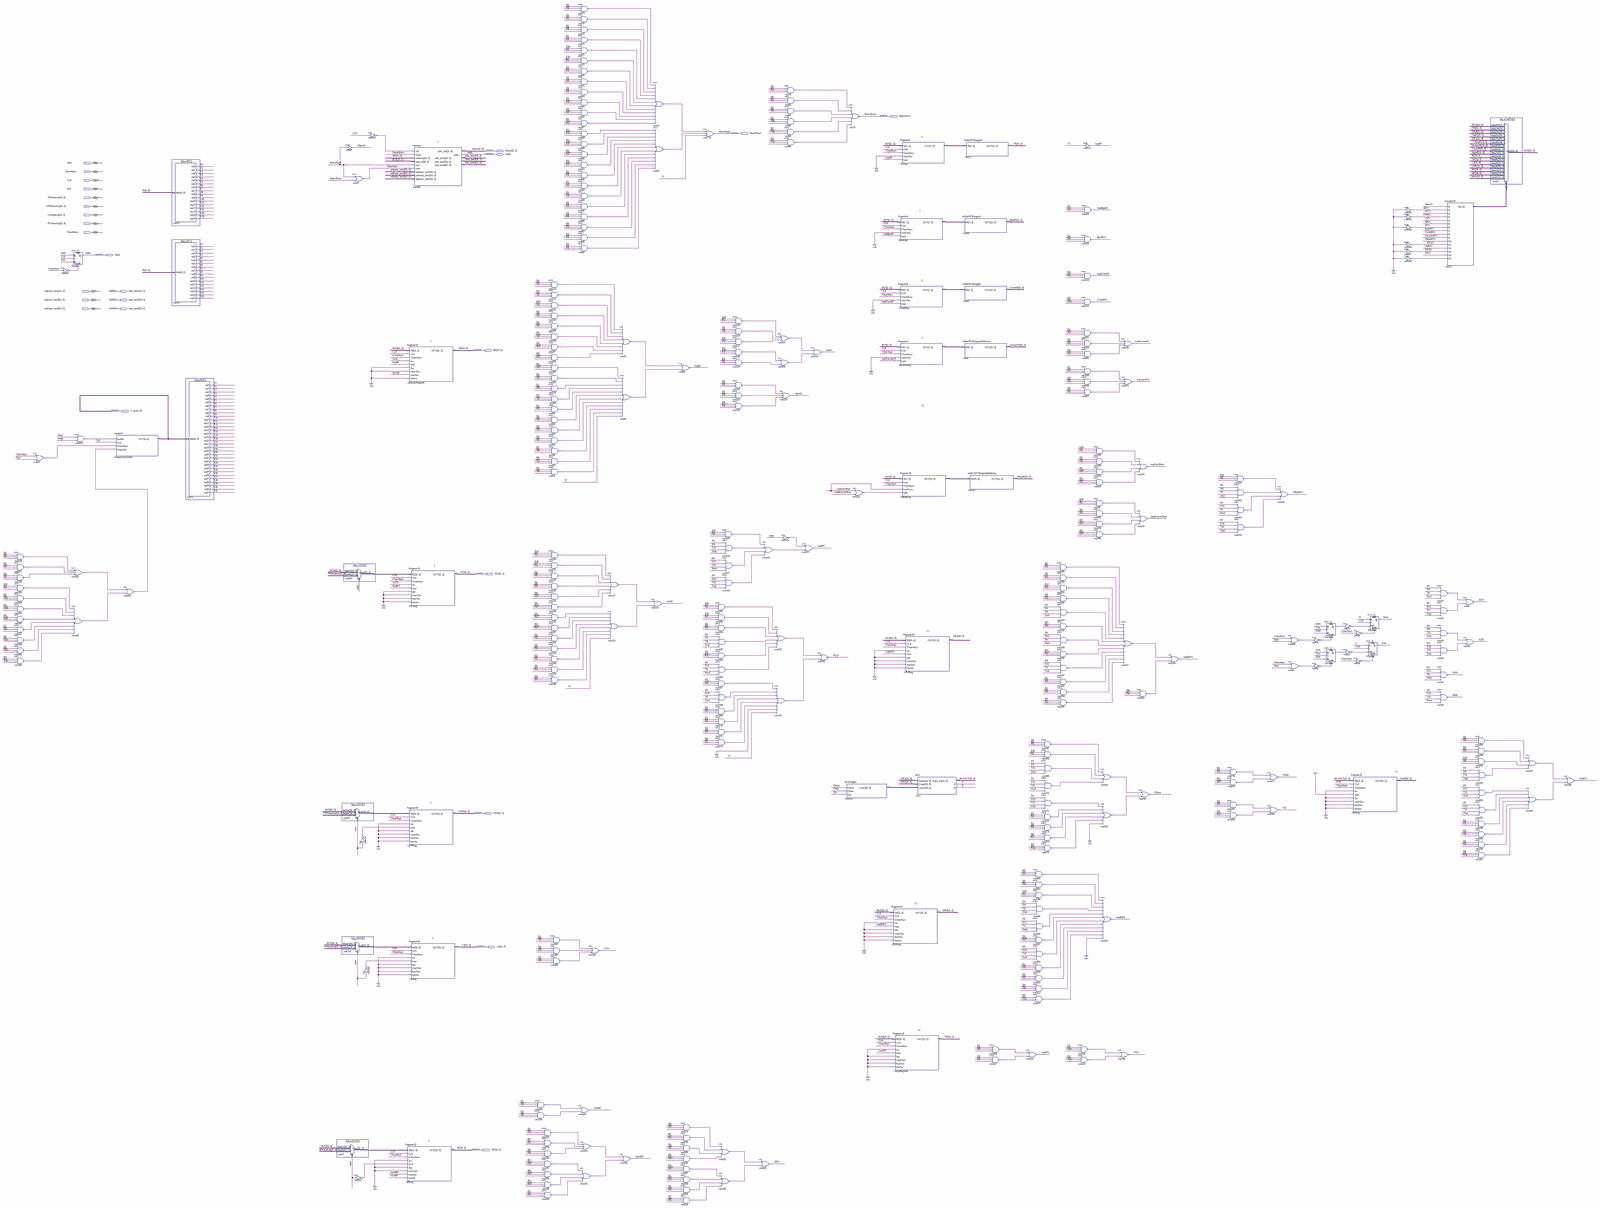
[diagram p0: schematic sheet, whole]
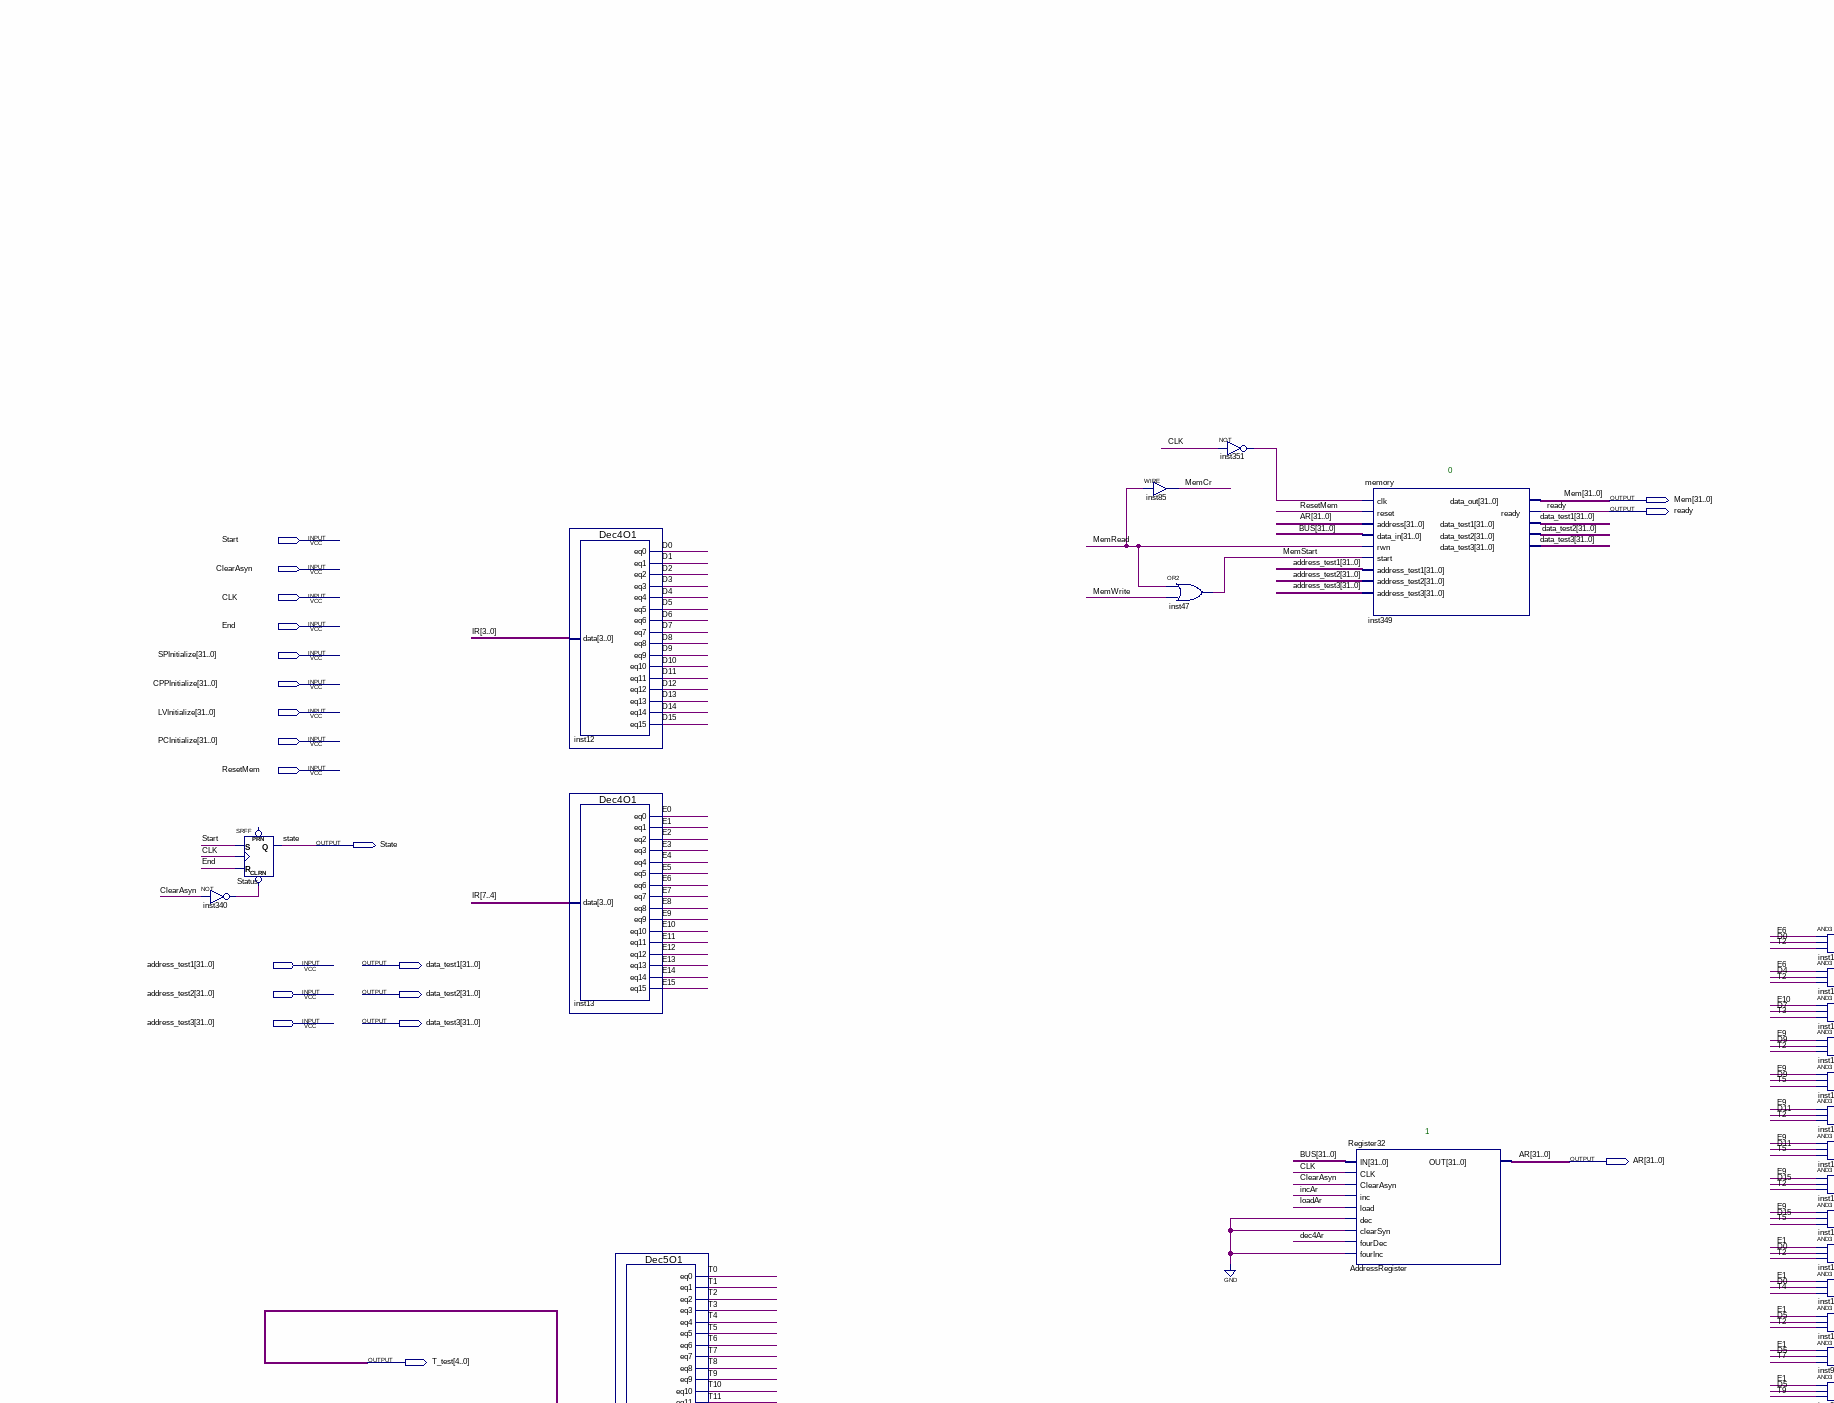
[diagram p1: schematic sheet, upper left part]
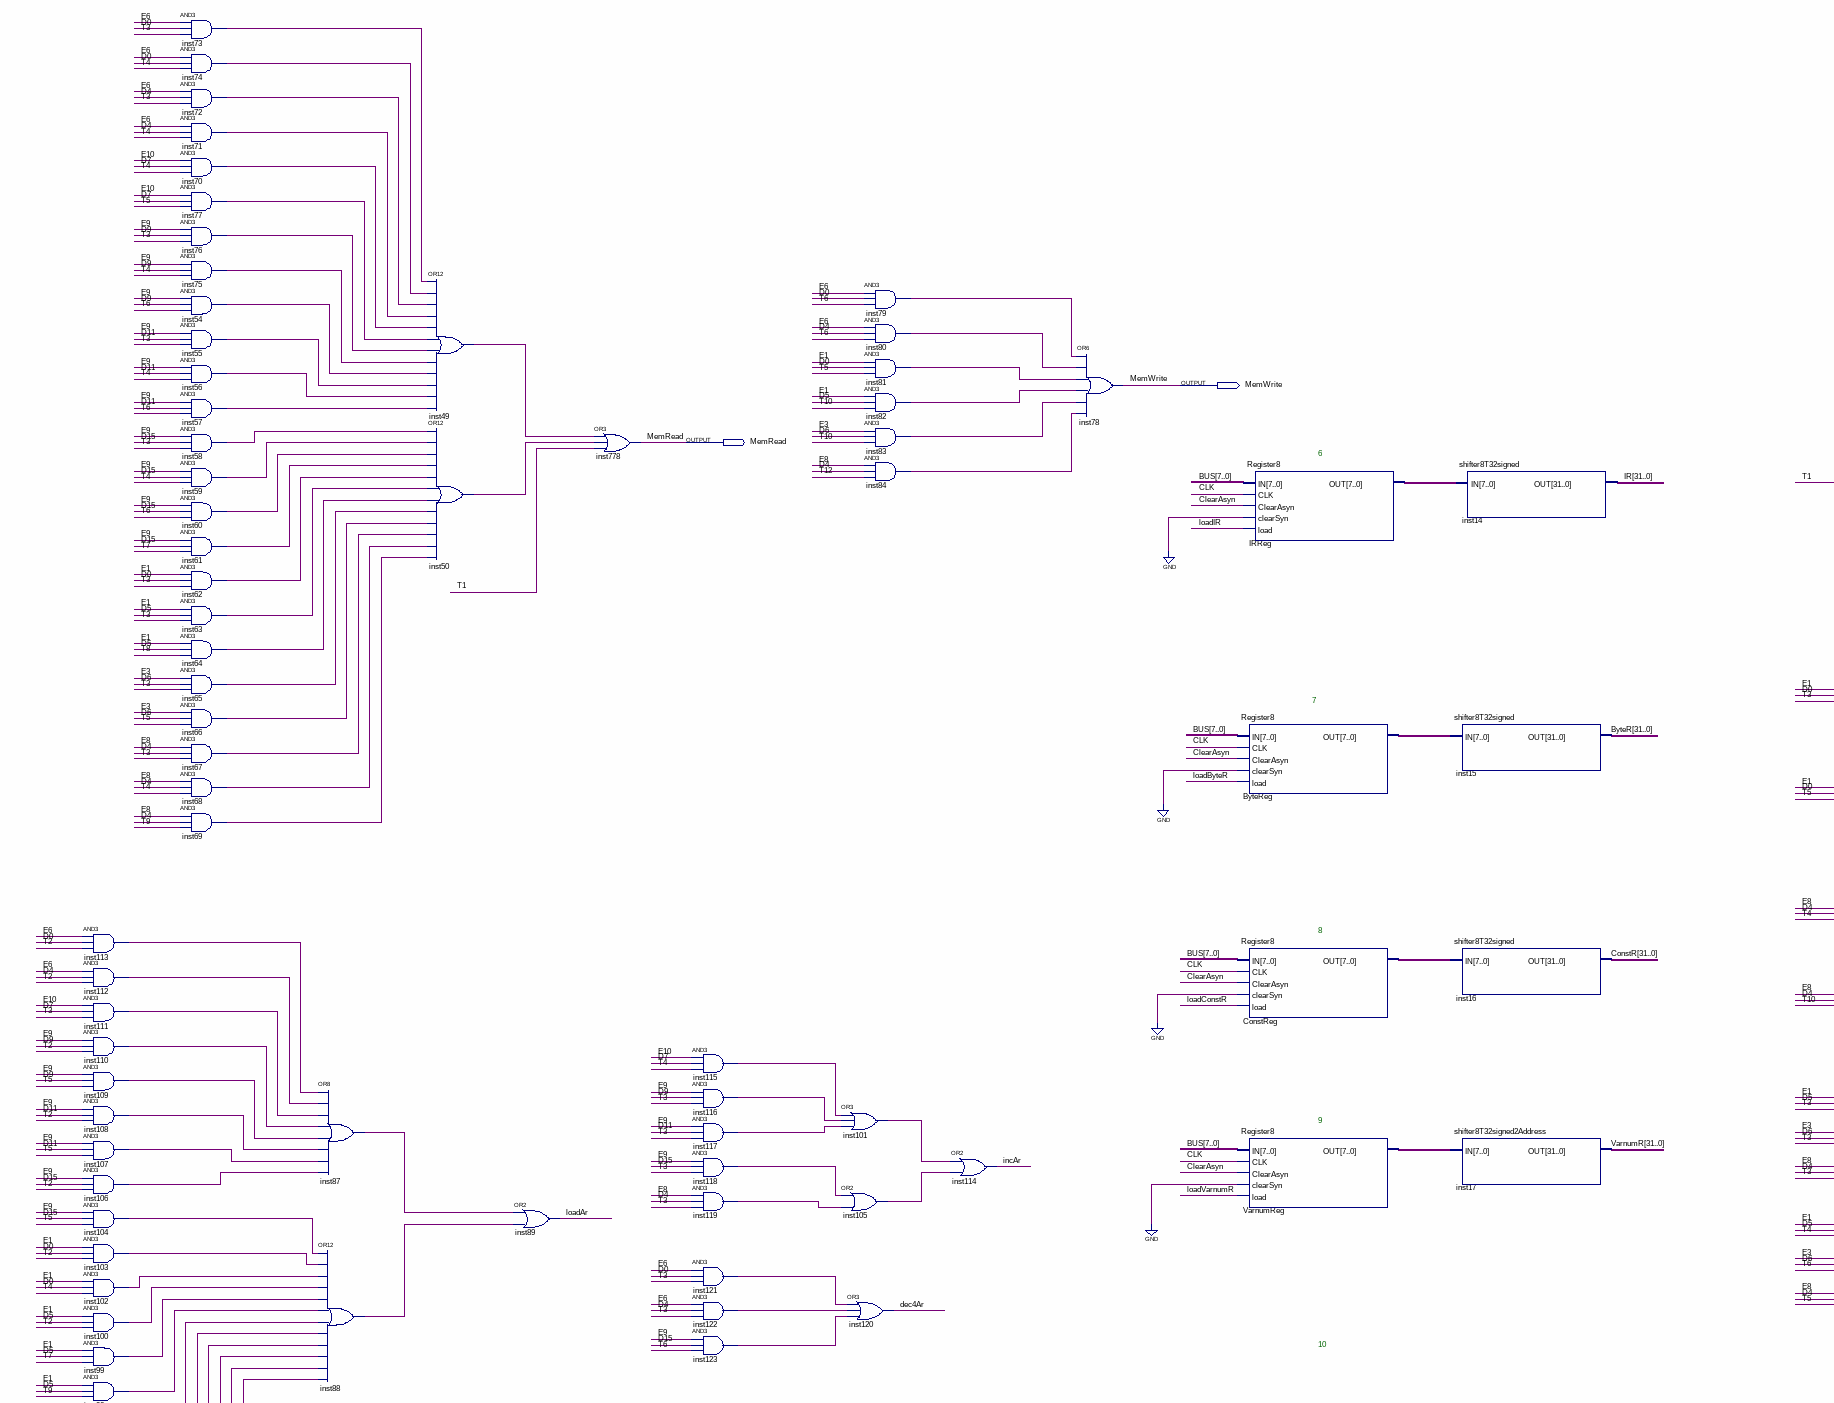
[diagram p2: schematic sheet, upper centre part]
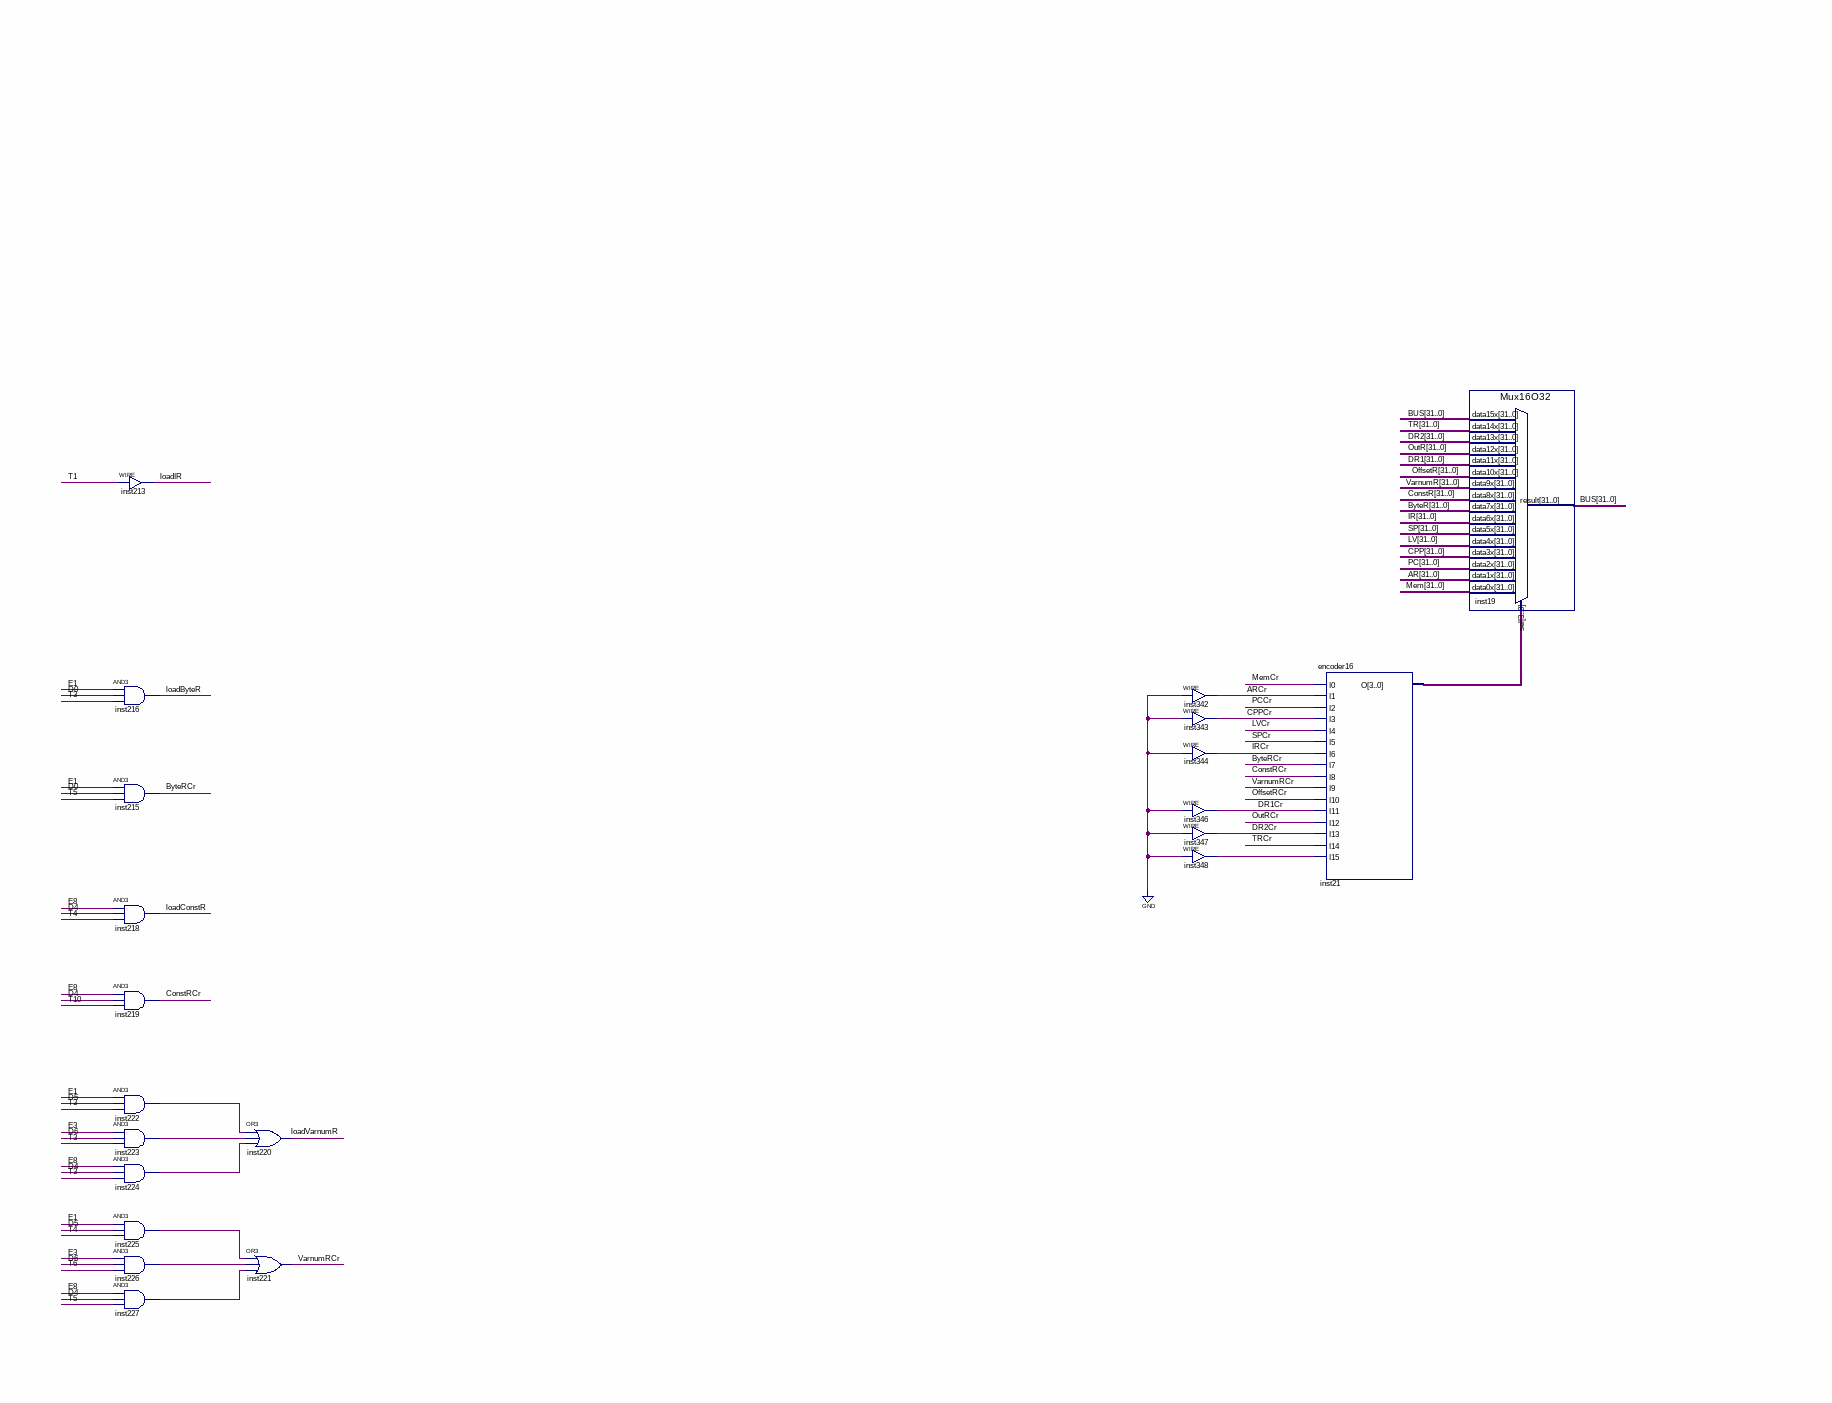
[diagram p3: schematic sheet, upper right part]
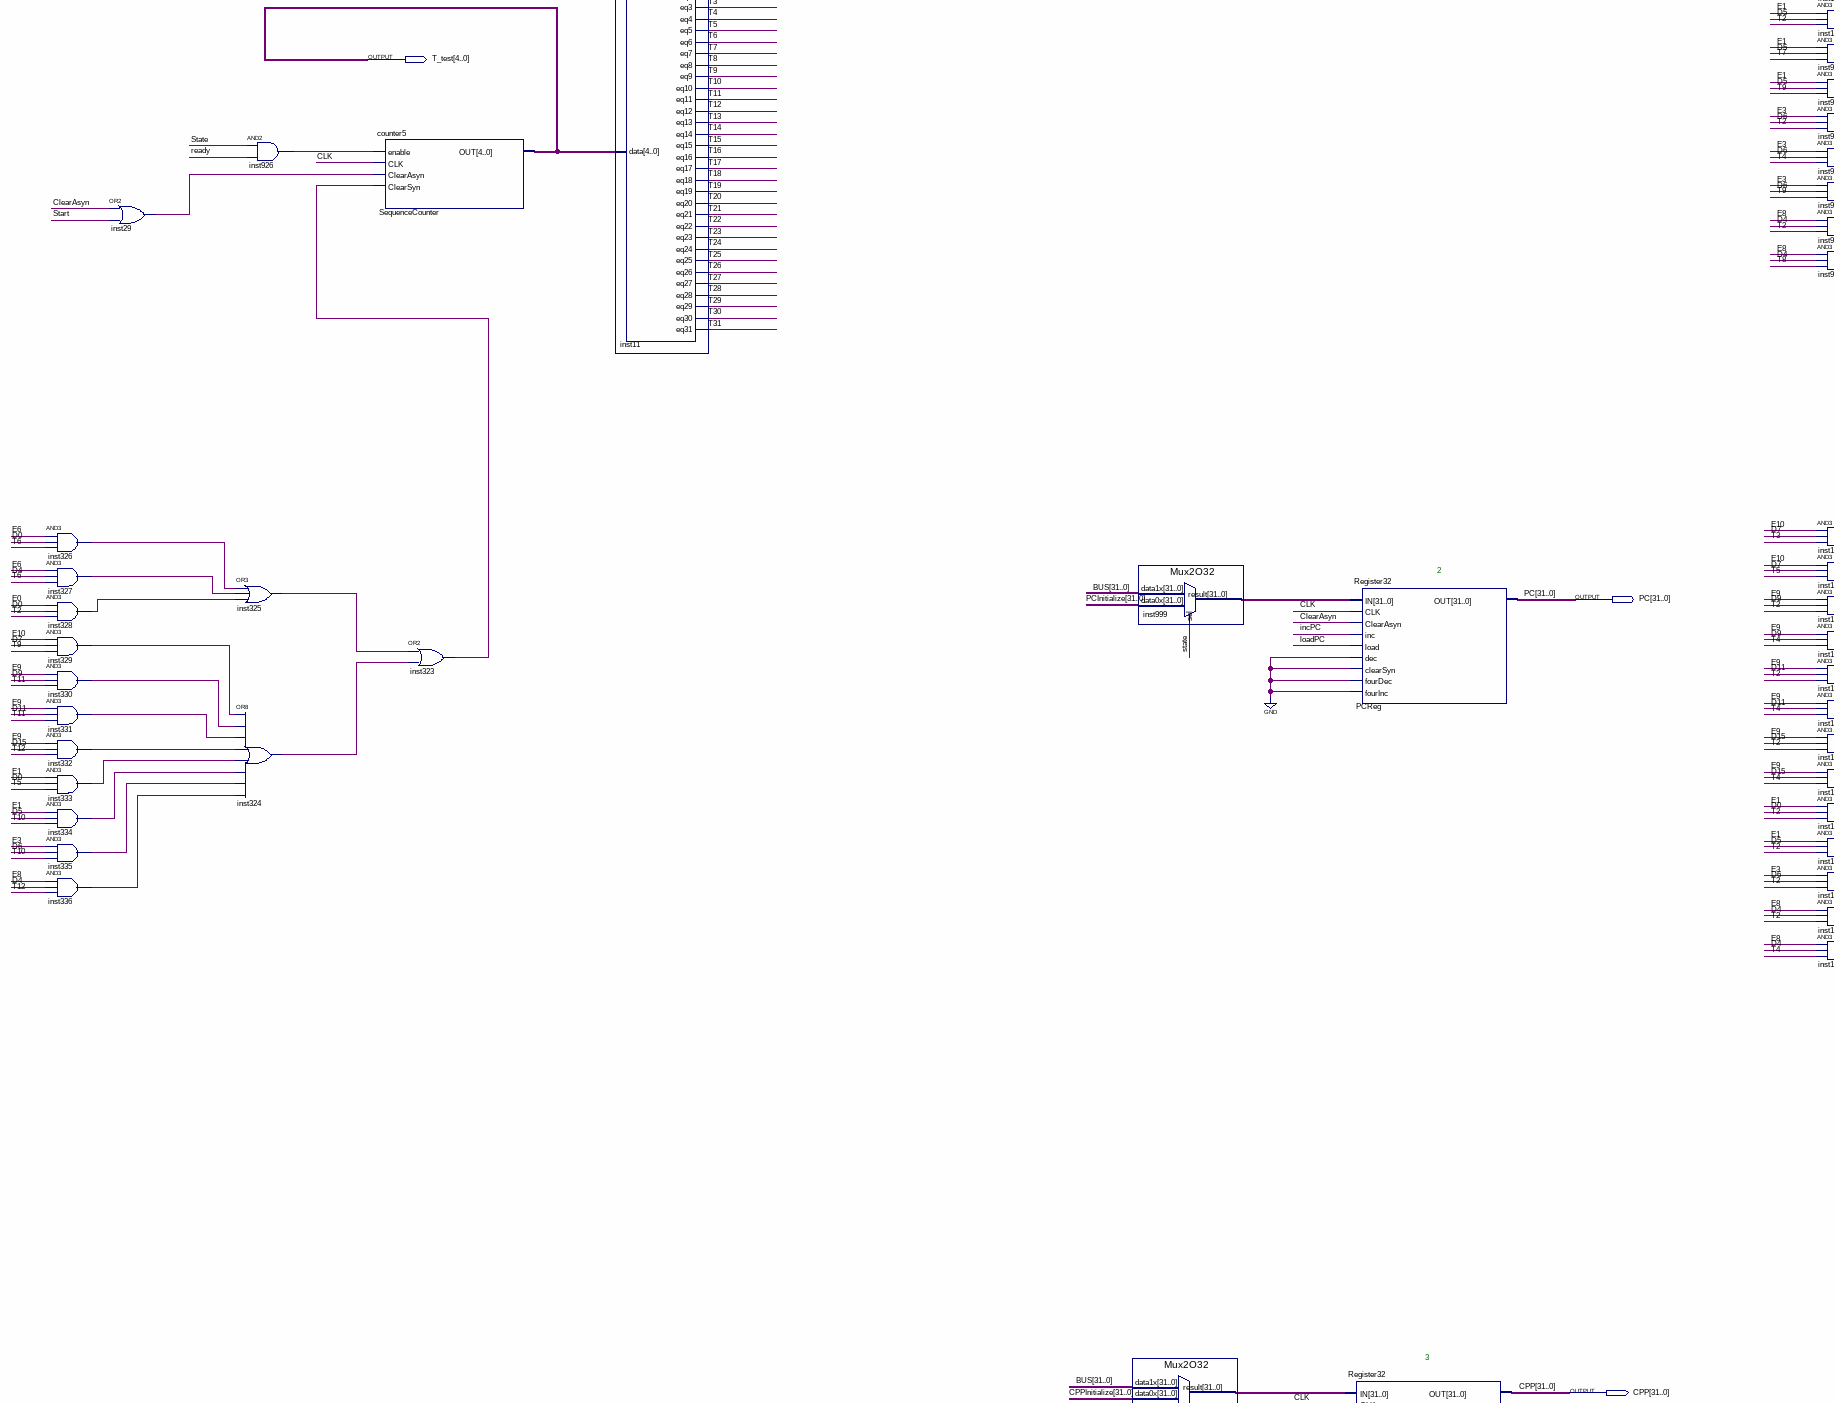
[diagram p4: schematic sheet, middle left part]
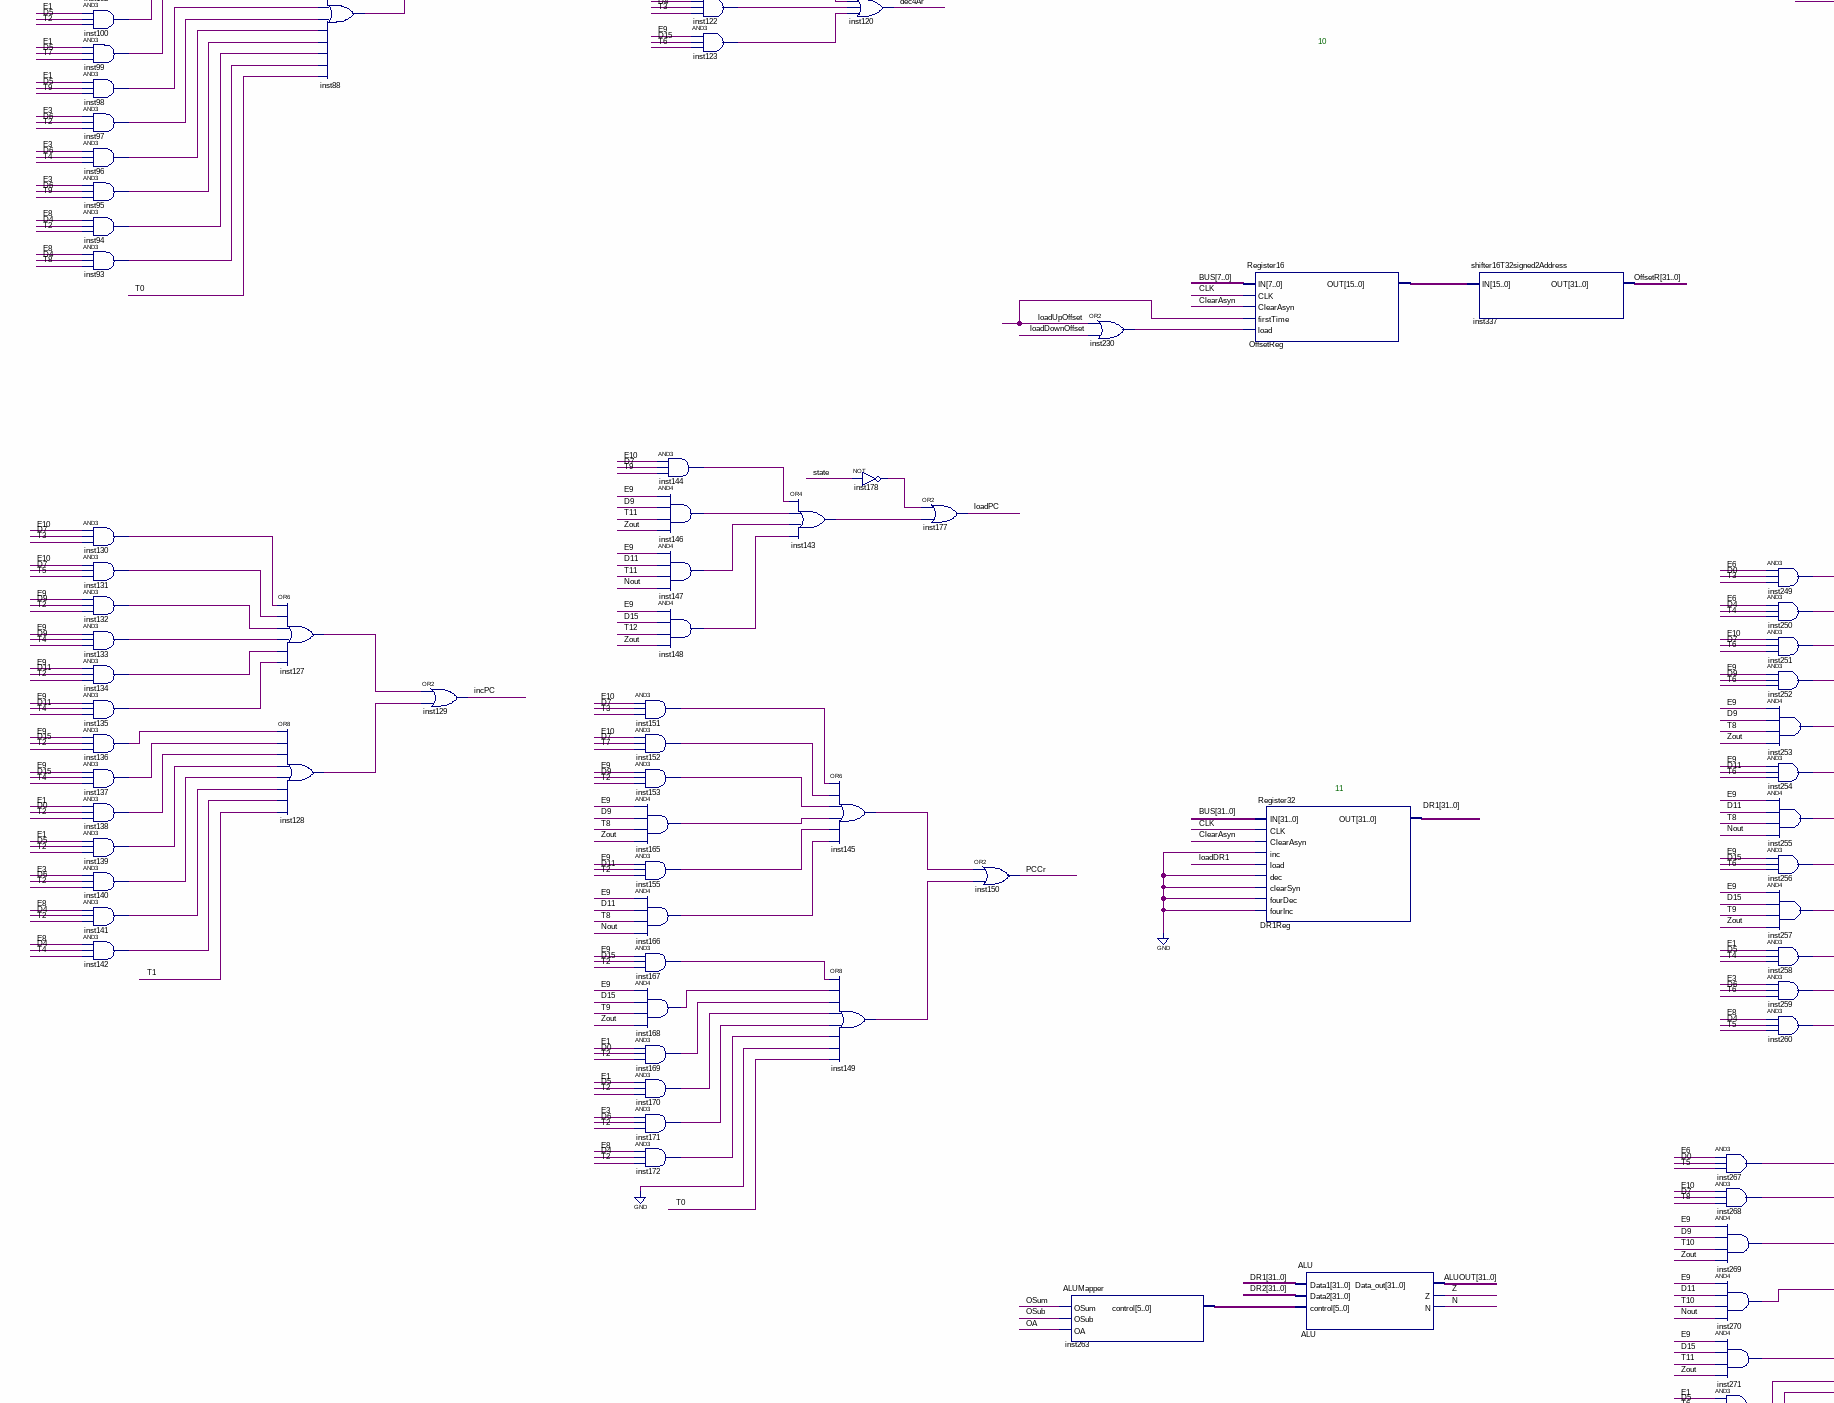
[diagram p5: schematic sheet, middle centre part]
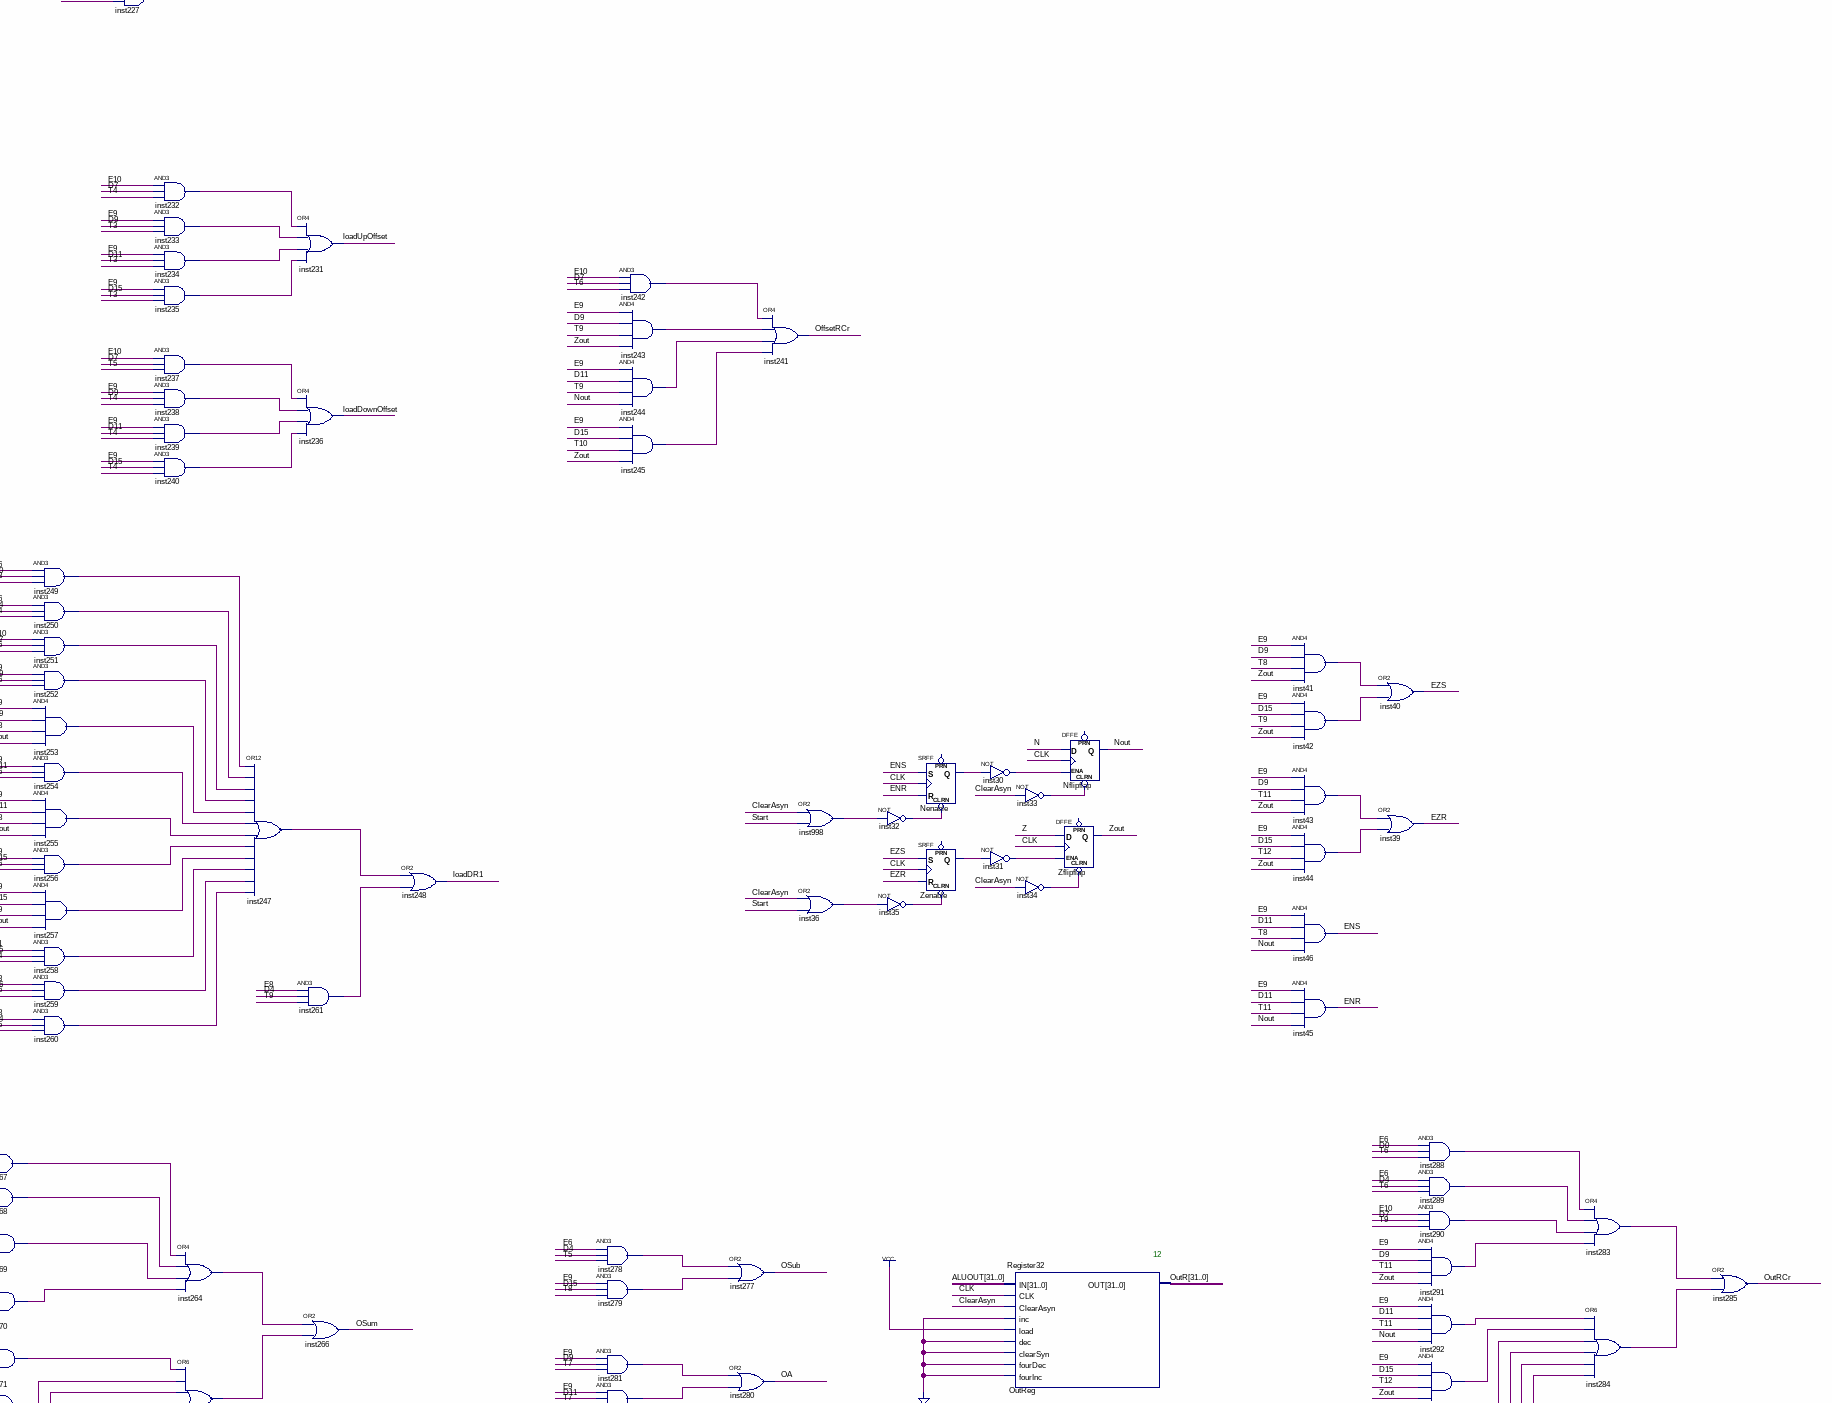
[diagram p6: schematic sheet, middle right part]
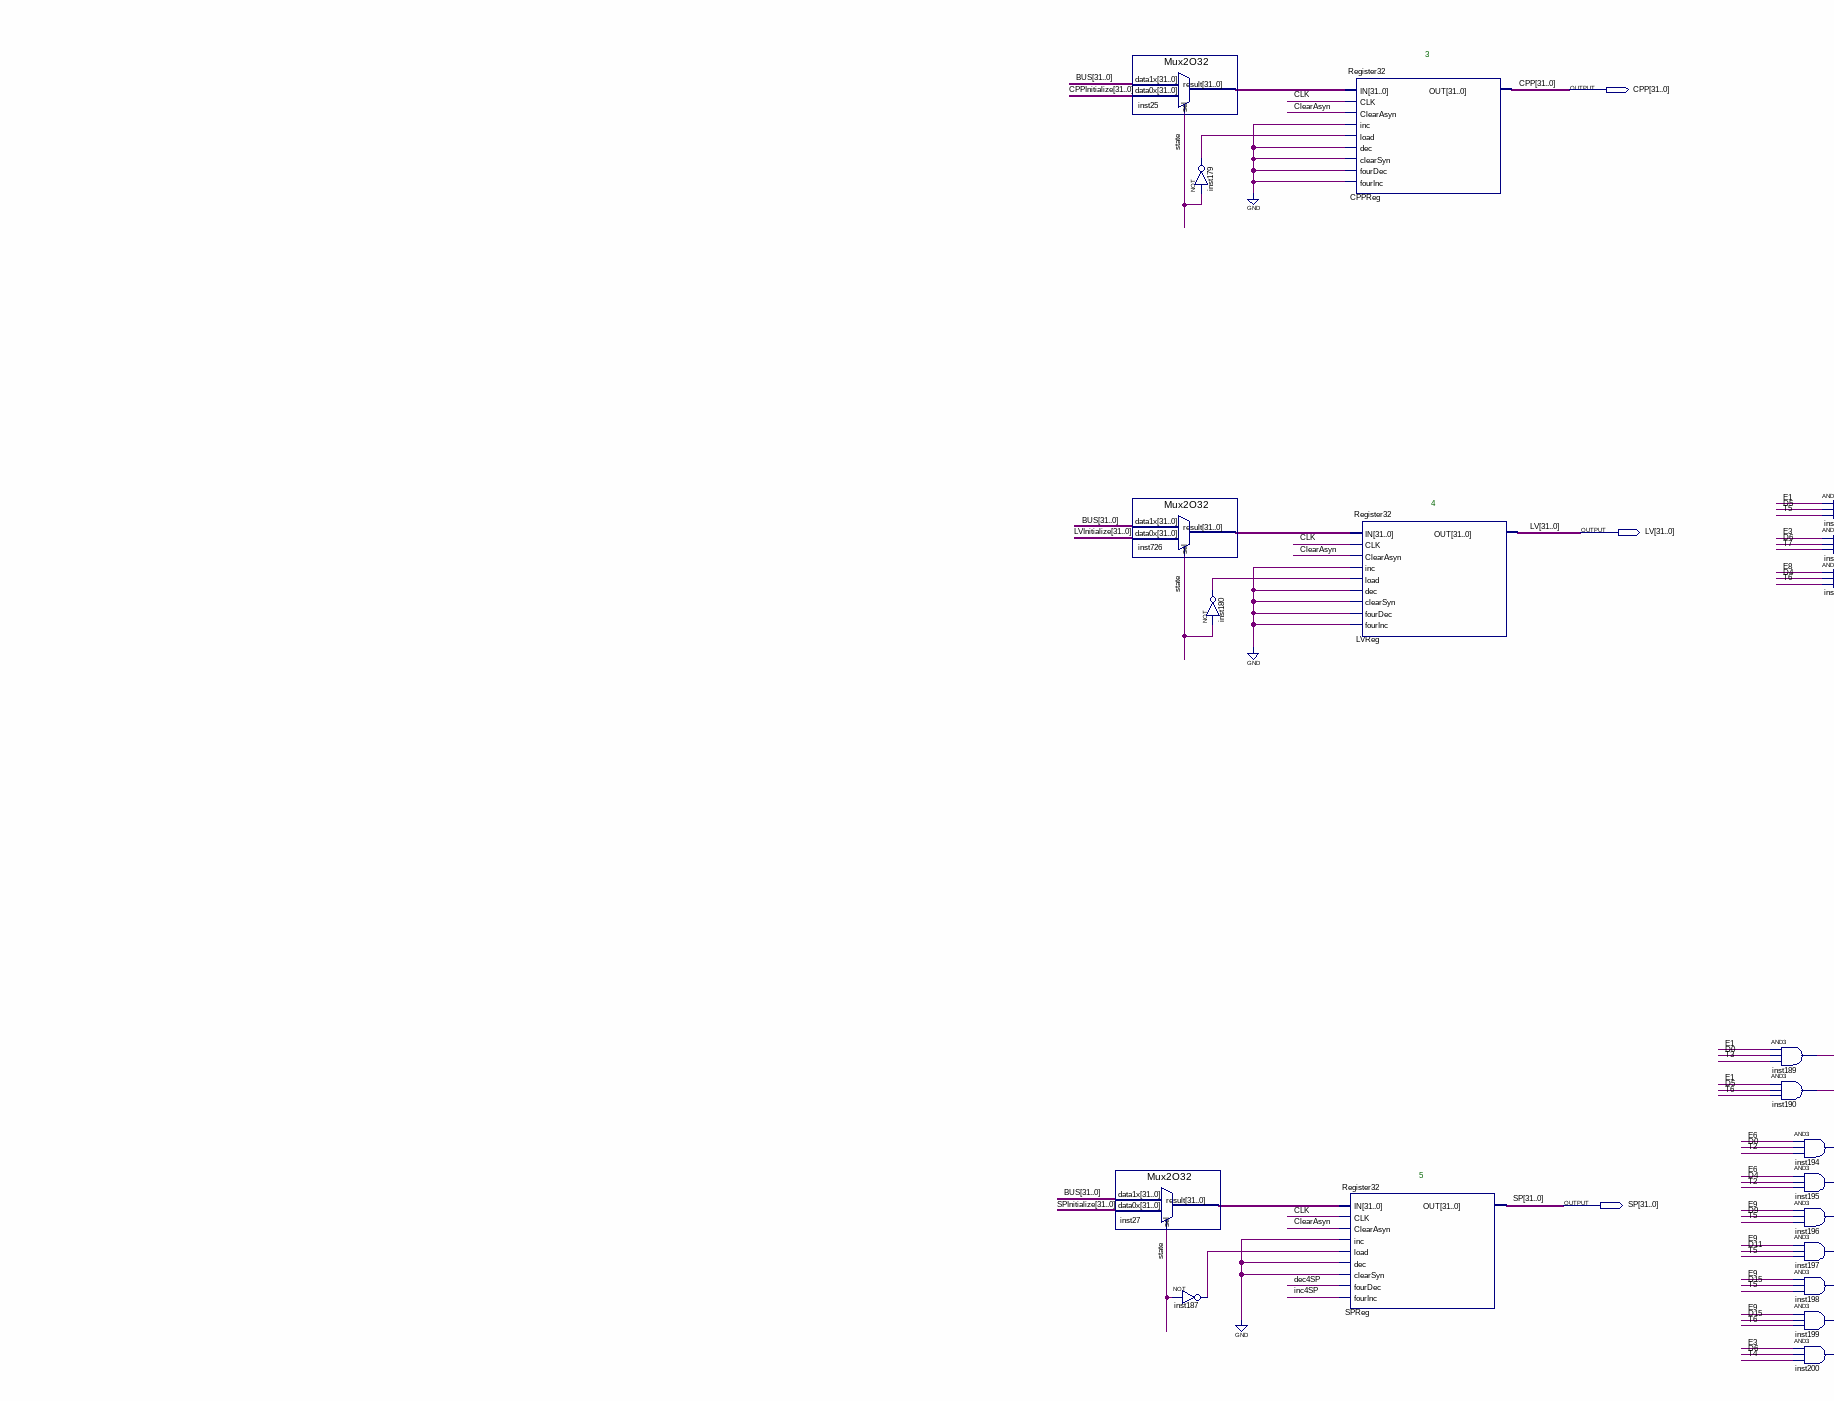
[diagram p7: schematic sheet, lower left part]
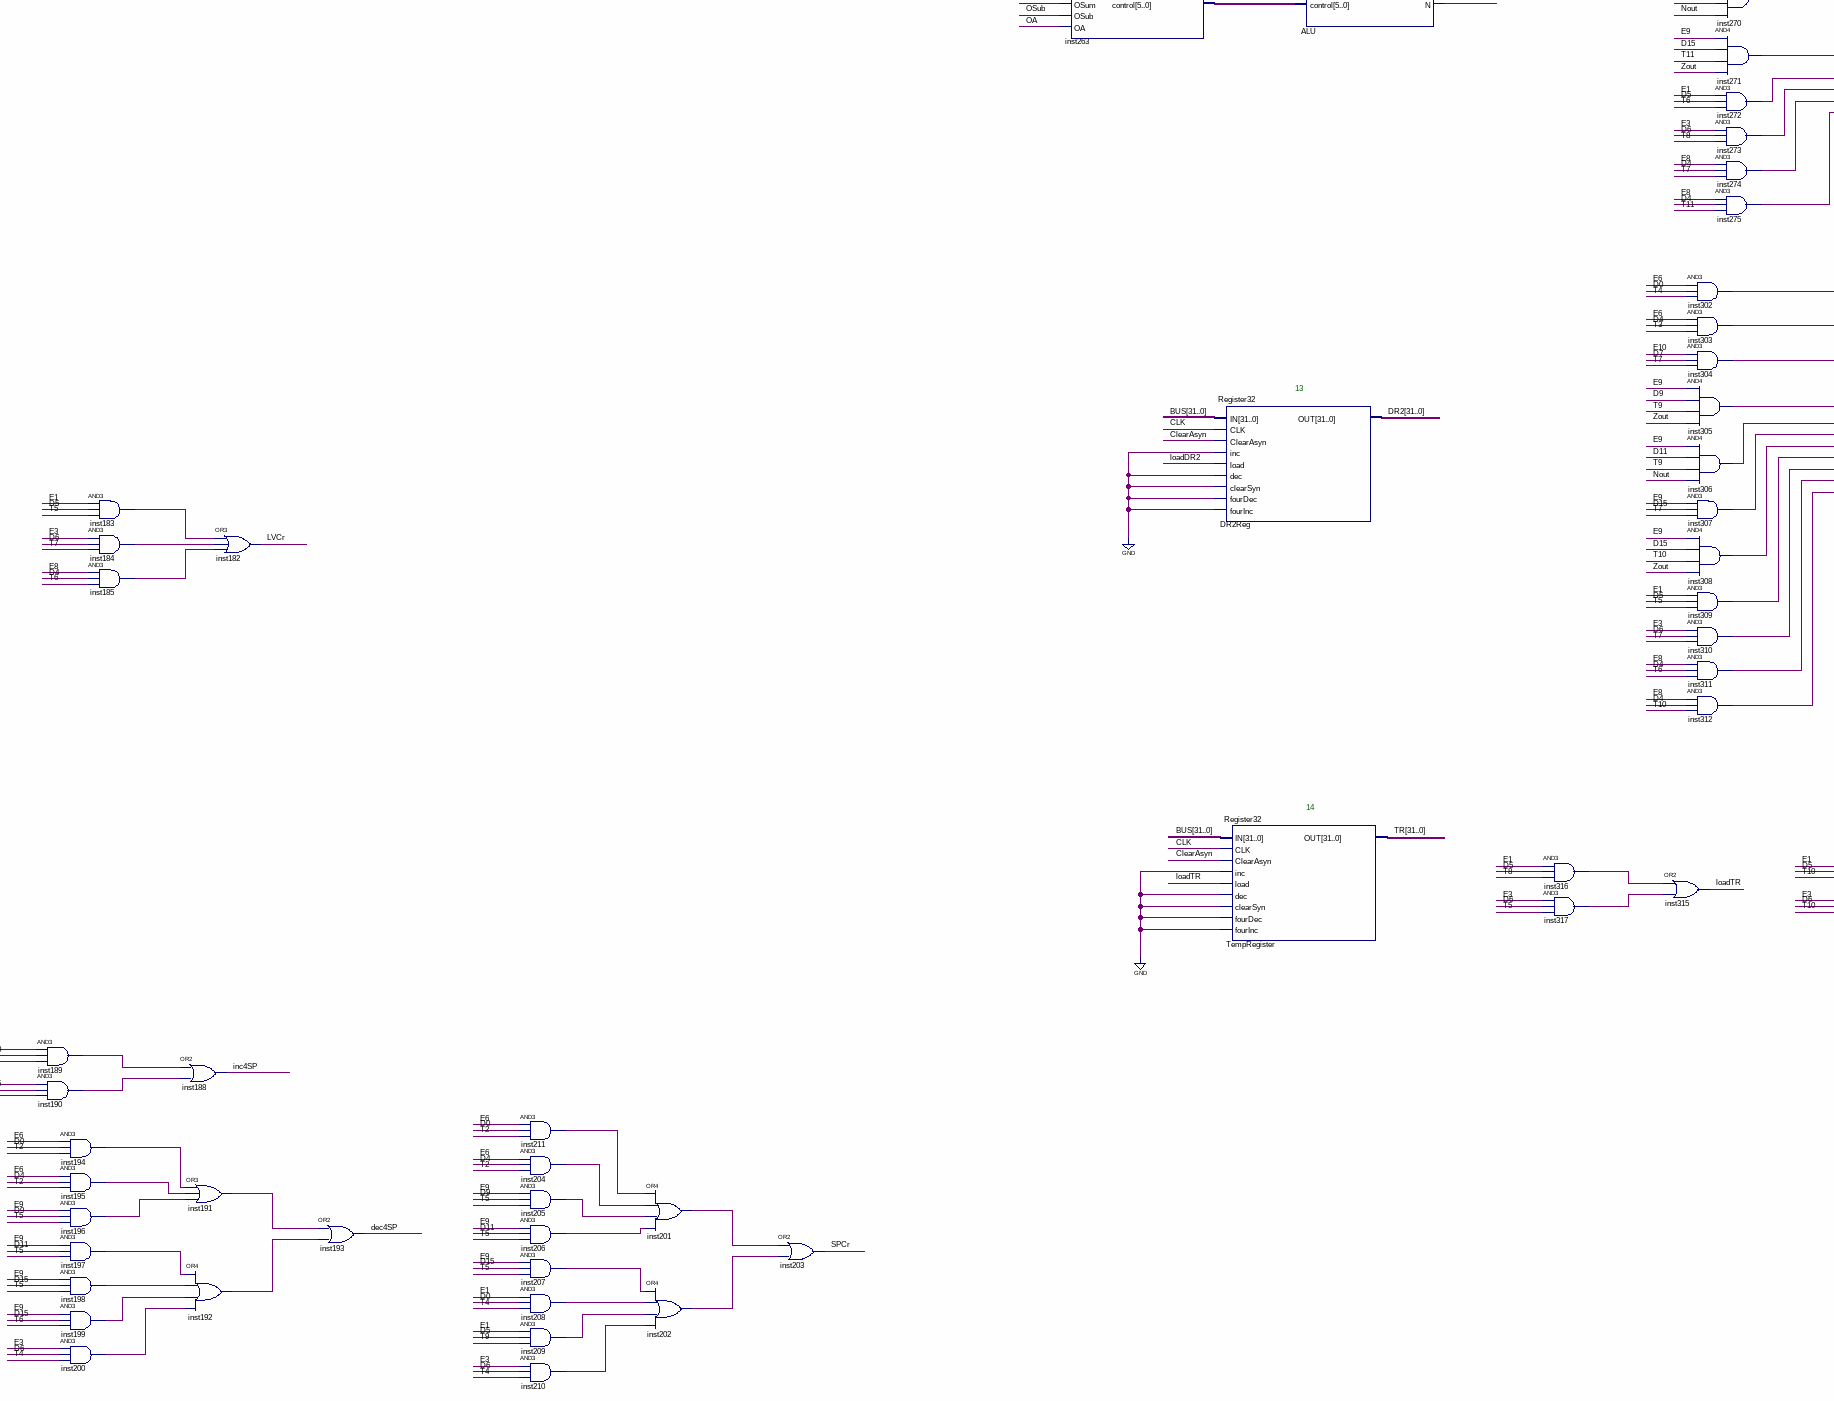
[diagram p8: schematic sheet, lower centre part]
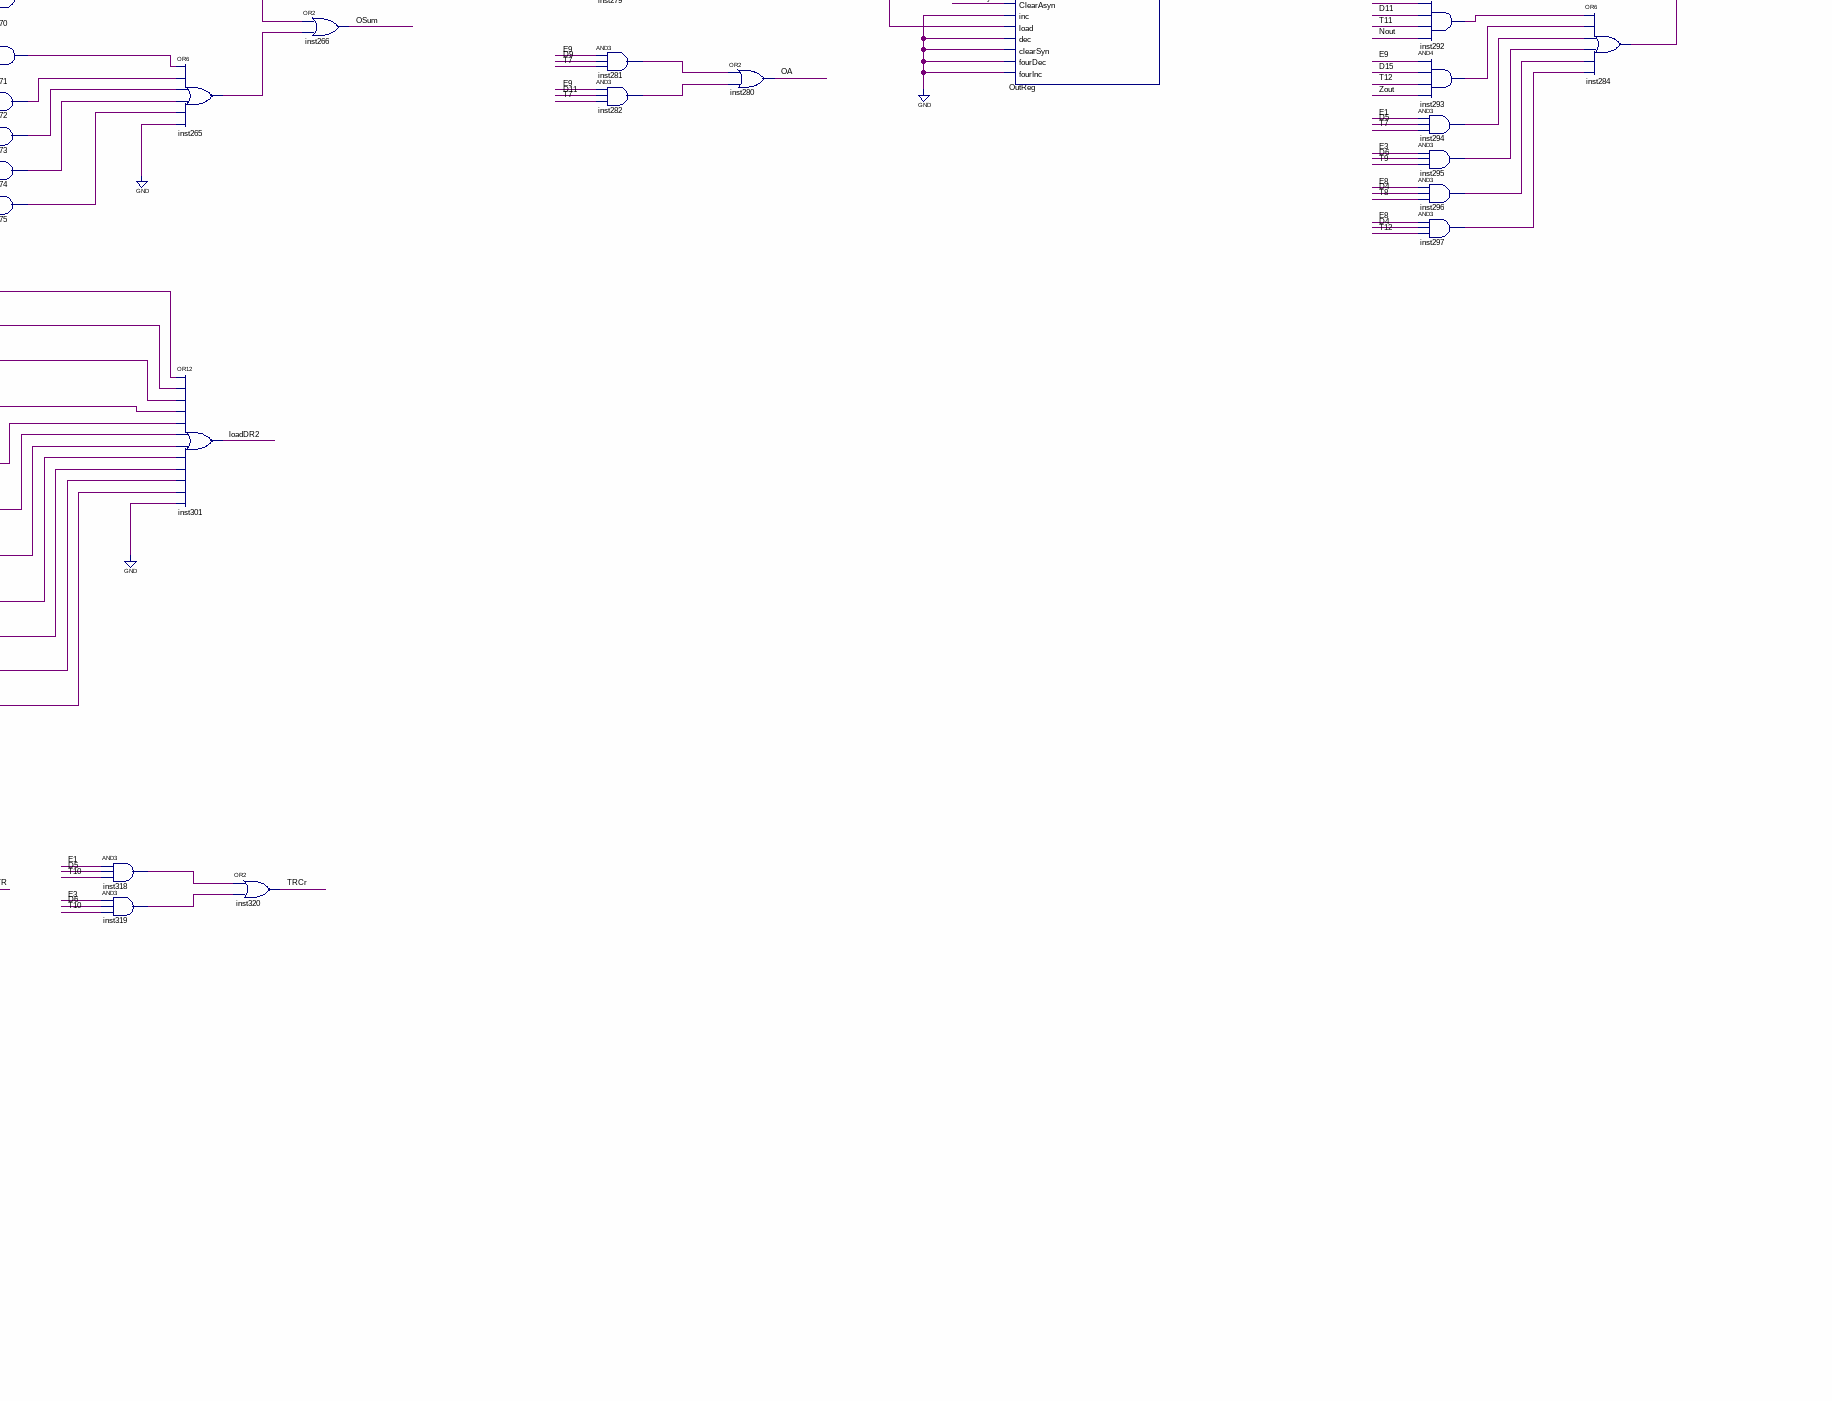
[diagram p9: schematic sheet, lower right part]
// Quartus schematic cpu.bdf as structural Verilog: 309 symbols, 26 pins
module cpu (
  input  Start,
  input  ClearAsyn,
  input  CLK,
  input  End,
  input  [31:0] SPInitialize,
  input  [31:0] CPPInitialize,
  input  [31:0] LVInitialize,
  input  [31:0] PCInitialize,
  input  ResetMem,
  input  [31:0] address_test1,
  input  [31:0] address_test2,
  input  [31:0] address_test3,
  output MemWrite,
  output MemRead,
  output [31:0] Mem,
  output ready,
  output State,
  output [31:0] data_test1,
  output [31:0] data_test2,
  output [31:0] data_test3,
  output [31:0] AR,
  output [4:0] T_test,
  output [31:0] PC,
  output [31:0] CPP,
  output [31:0] LV,
  output [31:0] SP
);

  wire ARCr, ByteRCr, ConstRCr, CPPCr, D0, D1, D2, D3, D4, D5, D6, D7, D8, D9, D10, D11, D12, D13, D14, D15,
       dec4Ar, dec4SP, DR1Cr, DR2Cr, E0, E1, E2, E3, E4, E5, E6, E7, E8, E9, E10, E11, E12, E13, E14, E15,
       ENR, ENS, EZR, EZS, inc4SP, incAr, incPC, inst29_out, inst30_out, inst31_out, inst32_out, inst33_out,
       inst34_out, inst35_out, inst36_out, inst41_out, inst42_out, inst43_out, inst44_out, inst49_out,
       inst50_out, inst54_out, inst55_out, inst56_out, inst57_out, inst58_out, inst59_out, inst60_out,
       inst61_out, inst62_out, inst63_out, inst64_out, inst65_out, inst66_out, inst67_out, inst68_out,
       inst69_out, inst70_out, inst71_out, inst72_out, inst73_out, inst74_out, inst75_out, inst76_out,
       inst77_out, inst79_out, inst80_out, inst81_out, inst82_out, inst83_out, inst84_out, inst87_out,
       inst88_out, inst93_out, inst94_out, inst95_out, inst96_out, inst97_out, inst98_out, inst99_out,
       inst100_out, inst101_out, inst102_out, inst103_out, inst104_out, inst105_out, inst106_out,
       inst107_out, inst108_out, inst109_out, inst110_out, inst111_out, inst112_out, inst113_out,
       inst115_out, inst116_out, inst117_out, inst118_out, inst119_out, inst121_out, inst122_out,
       inst123_out, inst127_out, inst128_out, inst130_out, inst131_out, inst132_out, inst133_out,
       inst134_out, inst135_out, inst136_out, inst137_out, inst138_out, inst139_out, inst140_out,
       inst141_out, inst142_out, inst143_out, inst144_out, inst145_out, inst146_out, inst147_out,
       inst148_out, inst149_out, inst151_out, inst152_out, inst153_out, inst155_out, inst165_out,
       inst166_out, inst167_out, inst168_out, inst169_out, inst170_out, inst171_out, inst172_out,
       inst178_out, inst179_out, inst180_out, inst183_out, inst184_out, inst185_out, inst187_out,
       inst189_out, inst190_out, inst191_out, inst192_out, inst194_out, inst195_out, inst196_out,
       inst197_out, inst198_out, inst199_out, inst200_out, inst201_out, inst202_out, inst204_out,
       inst205_out, inst206_out, inst207_out, inst208_out, inst209_out, inst210_out, inst211_out,
       inst222_out, inst223_out, inst224_out, inst225_out, inst226_out, inst227_out, inst230_out,
       inst232_out, inst233_out, inst234_out, inst235_out, inst237_out, inst238_out, inst239_out,
       inst240_out, inst242_out, inst243_out, inst244_out, inst245_out, inst247_out, inst249_out,
       inst250_out, inst251_out, inst252_out, inst253_out, inst254_out, inst255_out, inst256_out,
       inst257_out, inst258_out, inst259_out, inst260_out, inst261_out, inst264_out, inst265_out,
       inst267_out, inst268_out, inst269_out, inst270_out, inst271_out, inst272_out, inst273_out,
       inst274_out, inst275_out, inst278_out, inst279_out, inst281_out, inst282_out, inst283_out,
       inst284_out, inst288_out, inst289_out, inst290_out, inst291_out, inst292_out, inst293_out,
       inst294_out, inst295_out, inst296_out, inst297_out, inst302_out, inst303_out, inst304_out,
       inst305_out, inst306_out, inst307_out, inst308_out, inst309_out, inst310_out, inst311_out,
       inst312_out, inst316_out, inst317_out, inst318_out, inst319_out, inst323_out, inst324_out,
       inst325_out, inst326_out, inst327_out, inst328_out, inst329_out, inst330_out, inst331_out,
       inst332_out, inst333_out, inst334_out, inst335_out, inst336_out, inst340_out, inst348_out,
       inst351_out, inst926_out, inst998_out, IRCr, loadAr, loadByteR, loadConstR, loadDownOffset, loadDR1,
       loadDR2, loadIR, loadPC, loadTR, loadUpOffset, loadVarnumR, LVCr, MemCr, MemStart, N, Nenable_q, Nout,
       OA, OffsetRCr, OSub, OSum, OutRCr, PCCr, SPCr, T0, T1, T2, T3, T4, T5, T6, T7, T8, T9, T10, T11, T12,
       T13, T14, T15, T16, T17, T18, T19, T20, T21, T22, T23, T24, T25, T26, T27, T28, T29, T30, T31, TRCr,
       VarnumRCr, Z, Zenable_q, Zout;
  wire [3:0] inst21_o;
  wire [5:0] inst263_control;
  wire [7:0] ByteReg_out, ConstReg_out, IRReg_out, VarnumReg_out;
  wire [15:0] OffsetReg_out;
  wire [31:0] ALUOUT, BUS, ByteR, ConstR, DR1, DR2, inst25_result, inst27_result, inst726_result,
       inst999_result, IR, OffsetR, OutR, TR, VarnumR;

  and inst326 (inst326_out, E6, D0, T6);
  and inst327 (inst327_out, E6, D4, T6);
  and inst328 (inst328_out, E0, D0, T2);
  and inst329 (inst329_out, E10, D7, T9);
  and inst330 (inst330_out, E9, D9, T11);
  and inst331 (inst331_out, E9, D11, T11);
  and inst332 (inst332_out, E9, D15, T12);
  and inst333 (inst333_out, E1, D0, T5);
  and inst334 (inst334_out, E1, D5, T10);
  and inst335 (inst335_out, E3, D6, T10);
  and inst336 (inst336_out, E8, D4, T12);
  or inst29 (inst29_out, ClearAsyn, Start);
  not inst340 (inst340_out, ClearAsyn);
  SRFF Status (.CLRN(inst340_out), .S(Start), .R(End), .CLK(CLK), .Q(State));  // open: PRN
  and inst926 (inst926_out, State, ready);
  or inst325 (inst325_out, inst326_out, inst327_out, inst328_out);
  or inst324 (inst324_out, inst329_out, inst330_out, inst331_out, inst332_out, inst333_out, inst334_out, inst335_out, inst336_out);
  counter5 SequenceCounter (
    .enable(inst926_out), .CLK(CLK), .ClearAsyn(inst29_out), .ClearSyn(inst323_out), .OUT(T_test));
  or inst323 (inst323_out, inst325_out, inst324_out);
  Dec4O1 inst12 (
    .data(IR[3:0]), .eq0(D0), .eq1(D1), .eq2(D2), .eq3(D3), .eq4(D4), .eq5(D5), .eq6(D6), .eq7(D7), .eq8(D8),
    .eq9(D9), .eq10(D10), .eq11(D11), .eq12(D12), .eq13(D13), .eq14(D14), .eq15(D15));
  Dec4O1 inst13 (
    .data(IR[7:4]), .eq0(E0), .eq1(E1), .eq2(E2), .eq3(E3), .eq4(E4), .eq5(E5), .eq6(E6), .eq7(E7), .eq8(E8),
    .eq9(E9), .eq10(E10), .eq11(E11), .eq12(E12), .eq13(E13), .eq14(E14), .eq15(E15));
  Dec5O1 inst11 (
    .data(T_test), .eq0(T0), .eq1(T1), .eq2(T2), .eq3(T3), .eq4(T4), .eq5(T5), .eq6(T6), .eq7(T7), .eq8(T8),
    .eq9(T9), .eq10(T10), .eq11(T11), .eq12(T12), .eq13(T13), .eq14(T14), .eq15(T15), .eq16(T16), .eq17(T17),
    .eq18(T18), .eq19(T19), .eq20(T20), .eq21(T21), .eq22(T22), .eq23(T23), .eq24(T24), .eq25(T25),
    .eq26(T26), .eq27(T27), .eq28(T28), .eq29(T29), .eq30(T30), .eq31(T31));
  Mux2O32 inst27 (.data1x(BUS), .data0x(SPInitialize), .sel(State), .result(inst27_result));
  assign MemCr = MemRead;  // WIRE inst85
  or inst47 (MemStart, MemRead, MemWrite);
  Mux2O32 inst999 (.data1x(BUS), .data0x(PCInitialize), .sel(State), .result(inst999_result));
  Mux2O32 inst25 (.data1x(BUS), .data0x(CPPInitialize), .sel(State), .result(inst25_result));
  Mux2O32 inst726 (.data1x(BUS), .data0x(LVInitialize), .sel(State), .result(inst726_result));
  not inst187 (inst187_out, State);
  not inst351 (inst351_out, CLK);
  not inst179 (inst179_out, State);
  not inst180 (inst180_out, State);
  Register32 AddressRegister (
    .IN(BUS), .CLK(CLK), .ClearAsyn(ClearAsyn), .inc(incAr), .load(loadAr), .dec(1'b0), .clearSyn(1'b0),
    .fourDec(dec4Ar), .fourInc(1'b0), .OUT(AR));
  Register32 PCReg (
    .IN(inst999_result), .CLK(CLK), .ClearAsyn(ClearAsyn), .inc(incPC), .load(loadPC), .dec(1'b0),
    .clearSyn(1'b0), .fourDec(1'b0), .fourInc(1'b0), .OUT(PC));
  Register32 CPPReg (
    .IN(inst25_result), .CLK(CLK), .ClearAsyn(ClearAsyn), .inc(1'b0), .load(inst179_out), .dec(1'b0),
    .clearSyn(1'b0), .fourDec(1'b0), .fourInc(1'b0), .OUT(CPP));
  Register32 LVReg (
    .IN(inst726_result), .CLK(CLK), .ClearAsyn(ClearAsyn), .inc(1'b0), .load(inst180_out), .dec(1'b0),
    .clearSyn(1'b0), .fourDec(1'b0), .fourInc(1'b0), .OUT(LV));
  Register32 SPReg (
    .IN(inst27_result), .CLK(CLK), .ClearAsyn(ClearAsyn), .inc(1'b0), .load(inst187_out), .dec(1'b0),
    .clearSyn(1'b0), .fourDec(dec4SP), .fourInc(inc4SP), .OUT(SP));
  memory inst349 (
    .clk(inst351_out), .reset(ResetMem), .address(AR), .data_in(BUS), .rwn(MemRead), .start(MemStart),
    .address_test1(address_test1), .address_test2(address_test2), .address_test3(address_test3),
    .data_out(Mem), .ready(ready), .data_test1(data_test1), .data_test2(data_test2), .data_test3(data_test3));
  and inst189 (inst189_out, E1, D0, T3);
  and inst190 (inst190_out, E1, D5, T6);
  and inst113 (inst113_out, E6, D0, T2);
  and inst112 (inst112_out, E6, D4, T2);
  and inst111 (inst111_out, E10, D7, T3);
  and inst110 (inst110_out, E9, D9, T2);
  and inst109 (inst109_out, E9, D9, T5);
  and inst108 (inst108_out, E9, D11, T2);
  and inst107 (inst107_out, E9, D11, T5);
  and inst106 (inst106_out, E9, D15, T2);
  and inst104 (inst104_out, E9, D15, T5);
  and inst103 (inst103_out, E1, D0, T2);
  and inst102 (inst102_out, E1, D0, T4);
  and inst100 (inst100_out, E1, D5, T2);
  and inst99 (inst99_out, E1, D5, T7);
  and inst98 (inst98_out, E1, D5, T9);
  and inst97 (inst97_out, E3, D6, T2);
  and inst96 (inst96_out, E3, D6, T4);
  and inst95 (inst95_out, E3, D6, T9);
  and inst94 (inst94_out, E8, D4, T2);
  and inst93 (inst93_out, E8, D4, T8);
  and inst130 (inst130_out, E10, D7, T3);
  and inst131 (inst131_out, E10, D7, T5);
  and inst132 (inst132_out, E9, D9, T2);
  and inst133 (inst133_out, E9, D9, T4);
  and inst134 (inst134_out, E9, D11, T2);
  and inst135 (inst135_out, E9, D11, T4);
  and inst136 (inst136_out, E9, D15, T2);
  and inst137 (inst137_out, E9, D15, T4);
  and inst138 (inst138_out, E1, D0, T2);
  and inst139 (inst139_out, E1, D5, T2);
  and inst140 (inst140_out, E3, D6, T2);
  and inst141 (inst141_out, E8, D4, T2);
  and inst142 (inst142_out, E8, D4, T4);
  and inst194 (inst194_out, E6, D0, T2);
  and inst195 (inst195_out, E6, D4, T2);
  and inst196 (inst196_out, E9, D9, T5);
  and inst197 (inst197_out, E9, D11, T5);
  and inst198 (inst198_out, E9, D15, T5);
  and inst199 (inst199_out, E9, D15, T6);
  and inst200 (inst200_out, E3, D6, T4);
  and inst183 (inst183_out, E1, D5, T5);
  and inst184 (inst184_out, E3, D6, T7);
  and inst185 (inst185_out, E8, D4, T6);
  and inst73 (inst73_out, E6, D0, T3);
  and inst74 (inst74_out, E6, D0, T4);
  and inst72 (inst72_out, E6, D4, T3);
  and inst71 (inst71_out, E6, D4, T4);
  and inst70 (inst70_out, E10, D7, T4);
  and inst77 (inst77_out, E10, D7, T5);
  and inst76 (inst76_out, E9, D9, T3);
  and inst75 (inst75_out, E9, D9, T4);
  and inst54 (inst54_out, E9, D9, T6);
  and inst55 (inst55_out, E9, D11, T3);
  and inst56 (inst56_out, E9, D11, T4);
  and inst57 (inst57_out, E9, D11, T6);
  and inst58 (inst58_out, E9, D15, T3);
  and inst59 (inst59_out, E9, D15, T4);
  and inst60 (inst60_out, E9, D15, T6);
  and inst61 (inst61_out, E9, D15, T7);
  and inst62 (inst62_out, E1, D0, T3);
  and inst63 (inst63_out, E1, D5, T3);
  and inst64 (inst64_out, E1, D5, T8);
  and inst65 (inst65_out, E3, D6, T3);
  and inst66 (inst66_out, E3, D6, T5);
  and inst67 (inst67_out, E8, D4, T3);
  and inst68 (inst68_out, E8, D4, T4);
  and inst69 (inst69_out, E8, D4, T9);
  or inst182 (LVCr, inst183_out, inst184_out, inst185_out);
  or inst188 (inc4SP, inst189_out, inst190_out);
  or inst191 (inst191_out, inst194_out, inst195_out, inst196_out);
  or inst192 (inst192_out, inst197_out, inst198_out, inst199_out, inst200_out);
  or inst127 (inst127_out, inst130_out, inst131_out, inst132_out, inst133_out, inst134_out, inst135_out);
  or inst128 (inst128_out, inst136_out, inst137_out, inst138_out, inst139_out, inst140_out, inst141_out, inst142_out, T1);
  or inst87 (inst87_out, inst113_out, inst112_out, inst111_out, inst110_out, inst109_out, inst108_out, inst107_out, inst106_out);
  or inst88 (inst88_out, inst104_out, inst103_out, inst102_out, inst100_out, inst99_out, inst98_out, inst97_out, inst96_out, inst95_out, inst94_out, inst93_out, T0);
  or inst193 (dec4SP, inst191_out, inst192_out);
  or inst49 (inst49_out, inst73_out, inst74_out, inst72_out, inst71_out, inst70_out, inst77_out, inst76_out, inst75_out, inst54_out, inst55_out, inst56_out, inst57_out);
  or inst50 (inst50_out, inst58_out, inst59_out, inst60_out, inst61_out, inst62_out, inst63_out, inst64_out, inst65_out, inst66_out, inst67_out, inst68_out, inst69_out);
  or inst129 (incPC, inst127_out, inst128_out);
  or inst89 (loadAr, inst87_out, inst88_out);
  and inst211 (inst211_out, E6, D0, T2);
  and inst204 (inst204_out, E6, D4, T2);
  and inst205 (inst205_out, E9, D9, T5);
  and inst206 (inst206_out, E9, D11, T5);
  and inst207 (inst207_out, E9, D15, T5);
  and inst208 (inst208_out, E1, D0, T4);
  and inst209 (inst209_out, E1, D5, T9);
  and inst210 (inst210_out, E3, D6, T4);
  or inst778 (MemRead, inst49_out, inst50_out, T1);
  and inst151 (inst151_out, E10, D7, T3);
  and inst152 (inst152_out, E10, D7, T7);
  and inst153 (inst153_out, E9, D9, T2);
  and inst165 (inst165_out, E9, D9, T8, Zout);
  and inst155 (inst155_out, E9, D11, T2);
  and inst166 (inst166_out, E9, D11, T8, Nout);
  and inst167 (inst167_out, E9, D15, T2);
  and inst168 (inst168_out, E9, D15, T9, Zout);
  and inst169 (inst169_out, E1, D0, T2);
  and inst170 (inst170_out, E1, D5, T2);
  and inst171 (inst171_out, E3, D6, T2);
  and inst172 (inst172_out, E8, D4, T2);
  and inst144 (inst144_out, E10, D7, T9);
  and inst146 (inst146_out, E9, D9, T11, Zout);
  and inst147 (inst147_out, E9, D11, T11, Nout);
  and inst148 (inst148_out, E9, D15, T12, Zout);
  or inst201 (inst201_out, inst211_out, inst204_out, inst205_out, inst206_out);
  or inst202 (inst202_out, inst207_out, inst208_out, inst209_out, inst210_out);
  and inst115 (inst115_out, E10, D7, T4);
  and inst116 (inst116_out, E9, D9, T3);
  and inst117 (inst117_out, E9, D11, T3);
  and inst118 (inst118_out, E9, D15, T3);
  and inst119 (inst119_out, E8, D4, T3);
  and inst121 (inst121_out, E6, D0, T3);
  and inst122 (inst122_out, E6, D4, T3);
  and inst123 (inst123_out, E9, D15, T6);
  or inst143 (inst143_out, inst144_out, inst146_out, inst147_out, inst148_out);
  or inst203 (SPCr, inst201_out, inst202_out);
  and inst79 (inst79_out, E6, D0, T6);
  and inst80 (inst80_out, E6, D4, T6);
  and inst81 (inst81_out, E1, D0, T5);
  and inst82 (inst82_out, E1, D5, T10);
  and inst83 (inst83_out, E3, D6, T10);
  and inst84 (inst84_out, E8, D4, T12);
  or inst101 (inst101_out, inst115_out, inst116_out, inst117_out);
  or inst105 (inst105_out, inst118_out, inst119_out);
  or inst120 (dec4Ar, inst121_out, inst122_out, inst123_out);
  not inst178 (inst178_out, State);
  or inst145 (inst145_out, inst151_out, inst152_out, inst153_out, inst165_out, inst155_out, inst166_out);
  or inst149 (inst149_out, inst167_out, inst168_out, inst169_out, inst170_out, inst171_out, inst172_out, 1'b0, T0);
  or inst114 (incAr, inst101_out, inst105_out);
  or inst177 (loadPC, inst178_out, inst143_out);
  or inst150 (PCCr, inst145_out, inst149_out);
  or inst78 (MemWrite, inst79_out, inst80_out, inst81_out, inst82_out, inst83_out, inst84_out);
  or inst230 (inst230_out, loadUpOffset, loadDownOffset);
  ALUMapper inst263 (.OSum(OSum), .OSub(OSub), .OA(OA), .control(inst263_control));
  Register32 DR2Reg (
    .IN(BUS), .CLK(CLK), .ClearAsyn(ClearAsyn), .inc(1'b0), .load(loadDR2), .dec(1'b0), .clearSyn(1'b0),
    .fourDec(1'b0), .fourInc(1'b0), .OUT(DR2));
  Register32 TempRegister (
    .IN(BUS), .CLK(CLK), .ClearAsyn(ClearAsyn), .inc(1'b0), .load(loadTR), .dec(1'b0), .clearSyn(1'b0),
    .fourDec(1'b0), .fourInc(1'b0), .OUT(TR));
  Register8 IRReg (.IN(BUS[7:0]), .CLK(CLK), .ClearAsyn(ClearAsyn), .clearSyn(1'b0), .load(loadIR), .OUT(IRReg_out));
  Register8 ByteReg (
    .IN(BUS[7:0]), .CLK(CLK), .ClearAsyn(ClearAsyn), .clearSyn(1'b0), .load(loadByteR), .OUT(ByteReg_out));
  Register8 ConstReg (
    .IN(BUS[7:0]), .CLK(CLK), .ClearAsyn(ClearAsyn), .clearSyn(1'b0), .load(loadConstR), .OUT(ConstReg_out));
  Register8 VarnumReg (
    .IN(BUS[7:0]), .CLK(CLK), .ClearAsyn(ClearAsyn), .clearSyn(1'b0), .load(loadVarnumR), .OUT(VarnumReg_out));
  Register16 OffsetReg (
    .IN(BUS[7:0]), .CLK(CLK), .ClearAsyn(ClearAsyn), .firstTime(loadUpOffset), .load(inst230_out),
    .OUT(OffsetReg_out));
  Register32 DR1Reg (
    .IN(BUS), .CLK(CLK), .ClearAsyn(ClearAsyn), .inc(1'b0), .load(loadDR1), .dec(1'b0), .clearSyn(1'b0),
    .fourDec(1'b0), .fourInc(1'b0), .OUT(DR1));
  ALU ALU (.Data1(DR1), .Data2(DR2), .control(inst263_control), .Data_out(ALUOUT), .Z(Z), .N(N));
  shifter8T32signed inst14 (.IN(IRReg_out), .OUT(IR));
  shifter8T32signed inst15 (.IN(ByteReg_out), .OUT(ByteR));
  shifter8T32signed inst16 (.IN(ConstReg_out), .OUT(ConstR));
  shifter8T32signed2Address inst17 (.IN(VarnumReg_out), .OUT(VarnumR));
  shifter16T32signed2Address inst337 (.IN(OffsetReg_out), .OUT(OffsetR));
  and inst316 (inst316_out, E1, D5, T8);
  and inst317 (inst317_out, E3, D6, T5);
  and inst302 (inst302_out, E6, D0, T4);
  and inst303 (inst303_out, E6, D4, T3);
  and inst304 (inst304_out, E10, D7, T7);
  and inst305 (inst305_out, E9, D9, T9, Zout);
  and inst306 (inst306_out, E9, D11, T9, Nout);
  and inst307 (inst307_out, E9, D15, T7);
  and inst308 (inst308_out, E9, D15, T10, Zout);
  and inst309 (inst309_out, E1, D5, T5);
  and inst310 (inst310_out, E3, D6, T7);
  and inst311 (inst311_out, E8, D4, T6);
  and inst312 (inst312_out, E8, D4, T10);
  or inst315 (loadTR, inst316_out, inst317_out);
  and inst267 (inst267_out, E6, D0, T5);
  and inst268 (inst268_out, E10, D7, T8);
  and inst269 (inst269_out, E9, D9, T10, Zout);
  and inst270 (inst270_out, E9, D11, T10, Nout);
  and inst271 (inst271_out, E9, D15, T11, Zout);
  and inst272 (inst272_out, E1, D5, T6);
  and inst273 (inst273_out, E3, D6, T8);
  and inst274 (inst274_out, E8, D4, T7);
  and inst275 (inst275_out, E8, D4, T11);
  and inst249 (inst249_out, E6, D0, T3);
  and inst250 (inst250_out, E6, D4, T4);
  and inst251 (inst251_out, E10, D7, T6);
  and inst252 (inst252_out, E9, D9, T6);
  and inst253 (inst253_out, E9, D9, T8, Zout);
  and inst254 (inst254_out, E9, D11, T6);
  and inst255 (inst255_out, E9, D11, T8, Nout);
  and inst256 (inst256_out, E9, D15, T6);
  and inst257 (inst257_out, E9, D15, T9, Zout);
  and inst258 (inst258_out, E1, D5, T4);
  and inst259 (inst259_out, E3, D6, T6);
  and inst260 (inst260_out, E8, D4, T5);
  assign loadIR = T1;  // WIRE inst213
  and inst216 (loadByteR, E1, D0, T3);
  and inst215 (ByteRCr, E1, D0, T5);
  and inst218 (loadConstR, E8, D4, T4);
  and inst219 (ConstRCr, E8, D4, T10);
  and inst222 (inst222_out, E1, D5, T3);
  and inst223 (inst223_out, E3, D6, T3);
  and inst224 (inst224_out, E8, D4, T3);
  and inst225 (inst225_out, E1, D5, T4);
  and inst226 (inst226_out, E3, D6, T6);
  and inst227 (inst227_out, E8, D4, T5);
  and inst318 (inst318_out, E1, D5, T10);
  and inst319 (inst319_out, E3, D6, T10);
  and inst232 (inst232_out, E10, D7, T4);
  and inst233 (inst233_out, E9, D9, T3);
  and inst234 (inst234_out, E9, D11, T3);
  and inst235 (inst235_out, E9, D15, T3);
  and inst237 (inst237_out, E10, D7, T5);
  and inst238 (inst238_out, E9, D9, T4);
  and inst239 (inst239_out, E9, D11, T4);
  and inst240 (inst240_out, E9, D15, T4);
  or inst264 (inst264_out, inst267_out, inst268_out, inst269_out, inst270_out);
  or inst265 (inst265_out, inst271_out, inst272_out, inst273_out, inst274_out, inst275_out, 1'b0);
  or inst301 (loadDR2, inst302_out, inst303_out, inst304_out, inst305_out, inst306_out, inst307_out, inst308_out, inst309_out, inst310_out, inst311_out, inst312_out, 1'b0);
  or inst320 (TRCr, inst318_out, inst319_out);
  or inst220 (loadVarnumR, inst222_out, inst223_out, inst224_out);
  or inst221 (VarnumRCr, inst225_out, inst226_out, inst227_out);
  or inst247 (inst247_out, inst249_out, inst250_out, inst251_out, inst252_out, inst253_out, inst254_out, inst255_out, inst256_out, inst257_out, inst258_out, inst259_out, inst260_out);
  or inst231 (loadUpOffset, inst232_out, inst233_out, inst234_out, inst235_out);
  or inst236 (loadDownOffset, inst237_out, inst238_out, inst239_out, inst240_out);
  and inst261 (inst261_out, E8, D4, T9);
  or inst266 (OSum, inst264_out, inst265_out);
  or inst248 (loadDR1, inst247_out, inst261_out);
  and inst278 (inst278_out, E6, D4, T5);
  and inst279 (inst279_out, E9, D15, T8);
  and inst281 (inst281_out, E9, D9, T7);
  and inst282 (inst282_out, E9, D11, T7);
  and inst242 (inst242_out, E10, D7, T6);
  and inst243 (inst243_out, E9, D9, T9, Zout);
  and inst244 (inst244_out, E9, D11, T9, Nout);
  and inst245 (inst245_out, E9, D15, T10, Zout);
  or inst277 (OSub, inst278_out, inst279_out);
  or inst280 (OA, inst281_out, inst282_out);
  or inst241 (OffsetRCr, inst242_out, inst243_out, inst244_out, inst245_out);
  or inst998 (inst998_out, ClearAsyn, Start);
  or inst36 (inst36_out, ClearAsyn, Start);
  not inst32 (inst32_out, inst998_out);
  not inst35 (inst35_out, inst36_out);
  SRFF Nenable (.CLRN(inst32_out), .S(ENS), .R(ENR), .CLK(CLK), .Q(Nenable_q));  // open: PRN
  SRFF Zenable (.CLRN(inst35_out), .S(EZS), .R(EZR), .CLK(CLK), .Q(Zenable_q));  // open: PRN
  not inst30 (inst30_out, Nenable_q);
  not inst33 (inst33_out, ClearAsyn);
  not inst31 (inst31_out, Zenable_q);
  not inst34 (inst34_out, ClearAsyn);
  Register32 OutReg (
    .IN(ALUOUT), .CLK(CLK), .ClearAsyn(ClearAsyn), .inc(1'b0), .load(1'b1), .dec(1'b0), .clearSyn(1'b0),
    .fourDec(1'b0), .fourInc(1'b0), .OUT(OutR));
  DFFE Nflipflap (.CLRN(inst33_out), .D(N), .CLK(CLK), .ENA(inst30_out), .Q(Nout));  // open: PRN
  DFFE Zflipflap (.CLRN(inst34_out), .D(Z), .CLK(CLK), .ENA(inst31_out), .Q(Zout));  // open: PRN
  assign ARCr = 1'b0;  // WIRE inst342
  assign CPPCr = 1'b0;  // WIRE inst343
  assign IRCr = 1'b0;  // WIRE inst344
  assign DR1Cr = 1'b0;  // WIRE inst346
  assign DR2Cr = 1'b0;  // WIRE inst347
  assign inst348_out = 1'b0;  // WIRE inst348
  and inst41 (inst41_out, E9, D9, T8, Zout);
  and inst42 (inst42_out, E9, D15, T9, Zout);
  and inst43 (inst43_out, E9, D9, T11, Zout);
  and inst44 (inst44_out, E9, D15, T12, Zout);
  and inst46 (ENS, E9, D11, T8, Nout);
  and inst45 (ENR, E9, D11, T11, Nout);
  encoder16 inst21 (
    .I0(MemCr), .I1(ARCr), .I2(PCCr), .I3(CPPCr), .I4(LVCr), .I5(SPCr), .I6(IRCr), .I7(ByteRCr),
    .I8(ConstRCr), .I9(VarnumRCr), .I10(OffsetRCr), .I11(DR1Cr), .I12(OutRCr), .I13(DR2Cr), .I14(TRCr),
    .I15(inst348_out), .O(inst21_o));
  or inst40 (EZS, inst41_out, inst42_out);
  or inst39 (EZR, inst43_out, inst44_out);
  and inst288 (inst288_out, E6, D0, T6);
  and inst289 (inst289_out, E6, D4, T6);
  and inst290 (inst290_out, E10, D7, T9);
  and inst291 (inst291_out, E9, D9, T11, Zout);
  and inst292 (inst292_out, E9, D11, T11, Nout);
  and inst293 (inst293_out, E9, D15, T12, Zout);
  and inst294 (inst294_out, E1, D5, T7);
  and inst295 (inst295_out, E3, D6, T9);
  and inst296 (inst296_out, E8, D4, T8);
  and inst297 (inst297_out, E8, D4, T12);
  Mux16O32 inst19 (
    .data15x(BUS), .data14x(TR), .data13x(DR2), .data12x(OutR), .data11x(DR1), .data10x(OffsetR),
    .data9x(VarnumR), .data8x(ConstR), .data7x(ByteR), .data6x(IR), .data5x(SP), .data4x(LV), .data3x(CPP),
    .data2x(PC), .data1x(AR), .data0x(Mem), .sel(inst21_o), .result(BUS));
  or inst283 (inst283_out, inst288_out, inst289_out, inst290_out, inst291_out);
  or inst284 (inst284_out, inst292_out, inst293_out, inst294_out, inst295_out, inst296_out, inst297_out);
  or inst285 (OutRCr, inst283_out, inst284_out);

  // Notes on the sheet:
  //   6
  //   0
  //   7
  //   8
  //   9
  //   1
  //   10
  //   2
  //   11
  //   12
  //   3
  //   13
  //   4
  //   14
  //   5
endmodule
